# EAGLE design mainBoard_Gritsbot_3-0 (EAGLE 9.7.0)

## Sheet 1 of 5
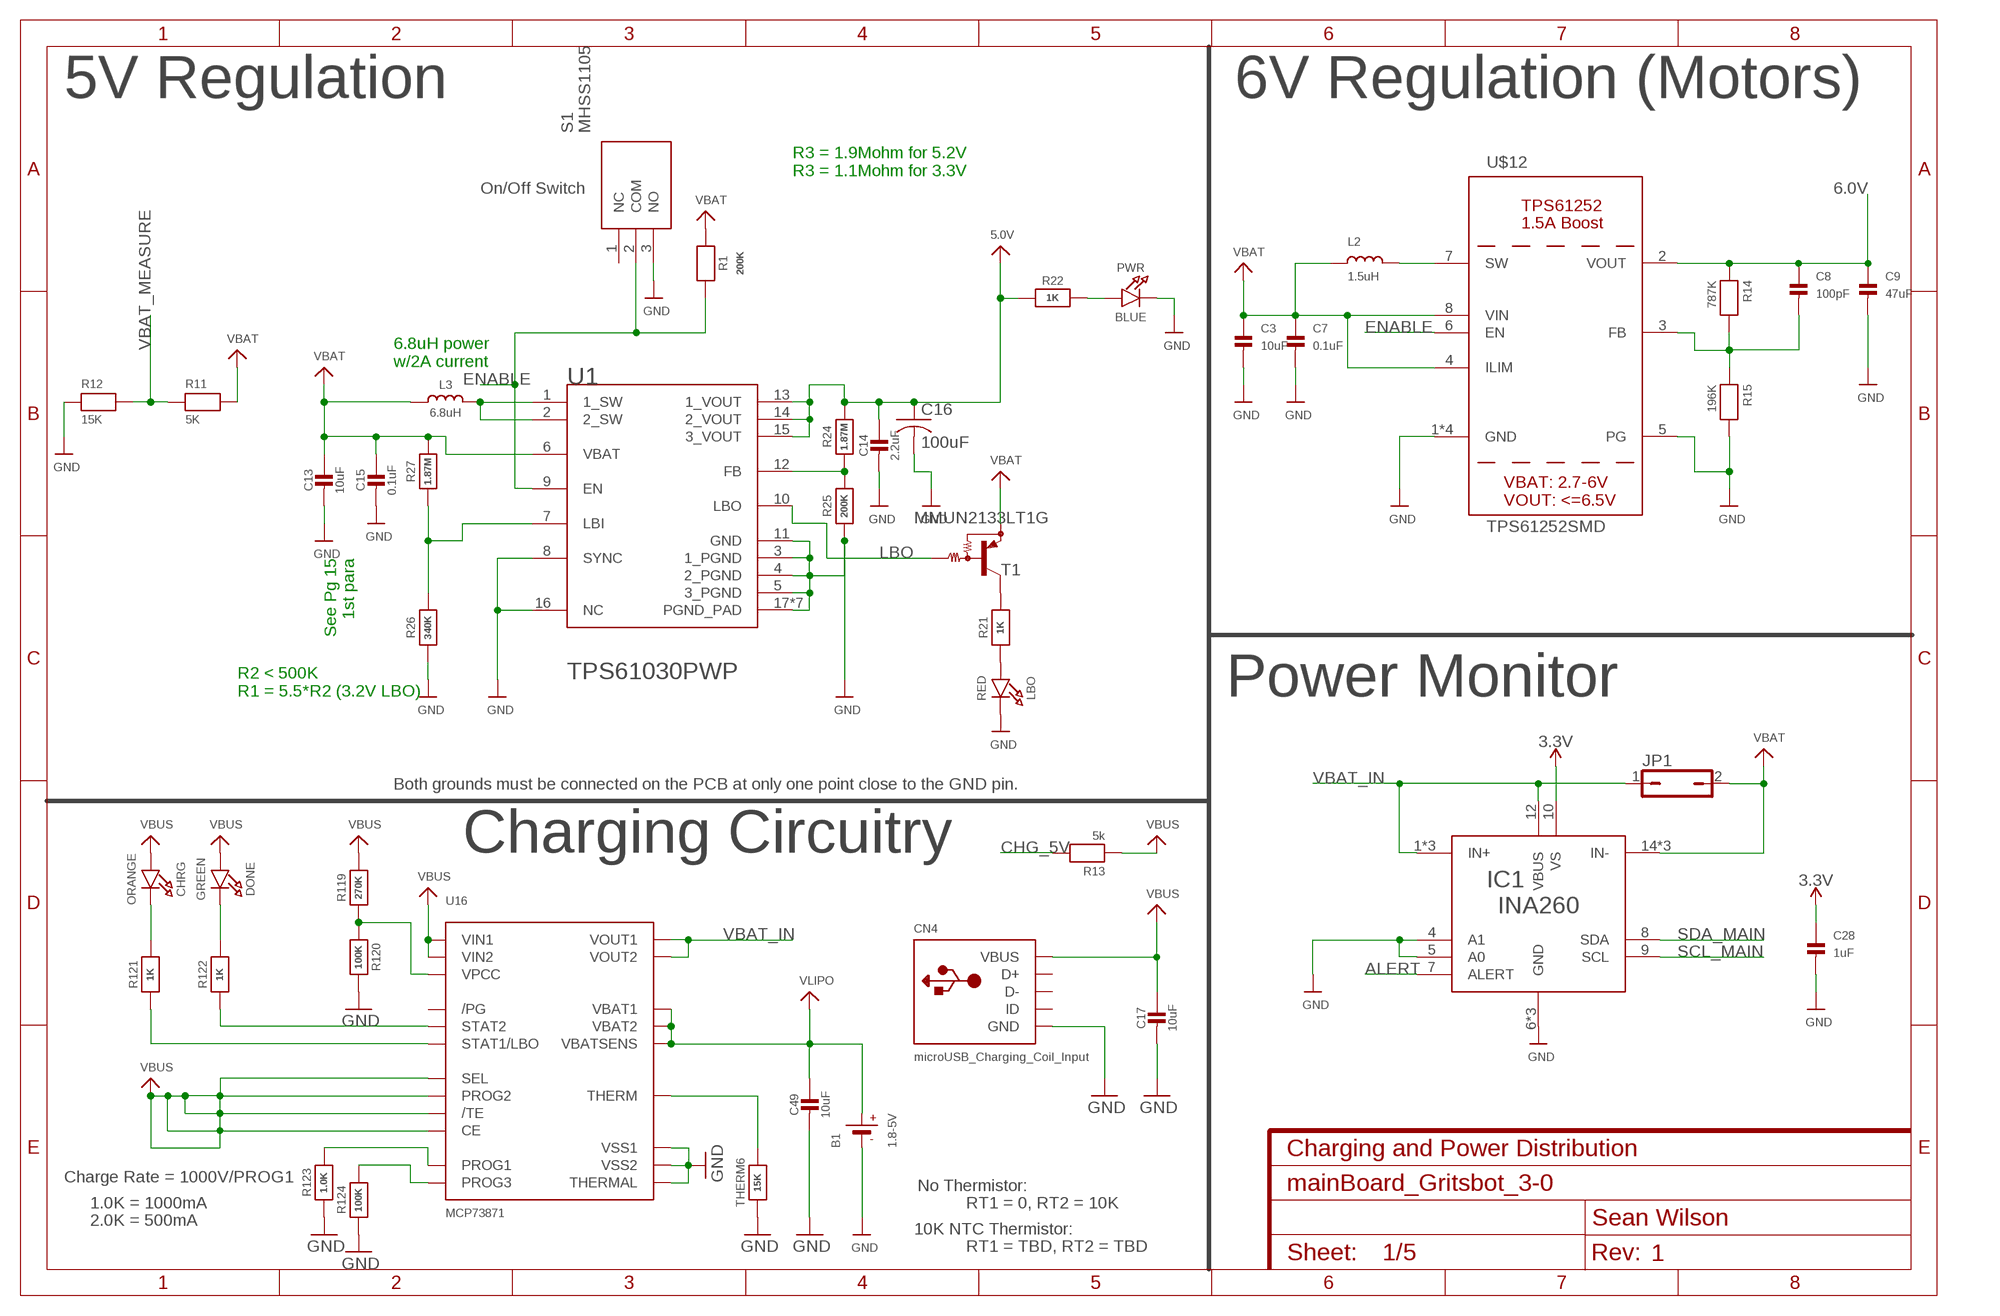
[diagram p0: schematic, sheet 1]
FRAME1 (FRAME-A4L): CNAME: Charging and Power Distribution; CREVISION: 1; DESIGNER: Sean Wilson

### Parts
B1  1.8-5V  BATTERY  [JSTPH2]
C3  10uF  CAP_CERAMIC0603  [0603]
C7  0.1uF  CAP_CERAMIC0805  [0805]
C8  100pF  CAP_CERAMIC0603  [0603]
C9  47uF  CAP_CERAMIC1206  [1206]
C13  10uF  CAP_CERAMIC0805-NOOUTLINE  [0805-NO]
C14  2.2uF  CAP_CERAMIC0805-NOOUTLINE  [0805-NO]
C15  0.1uF  CAP_CERAMIC0805_10MGAP  [0805_10MGAP]
C16  100uF  C-USC1210  [C1210]
C17  10uF  CAP_CERAMIC0805-NOOUTLINE  [0805-NO]
C28  1uF  CAP_CERAMIC0603_NO  [0603-NO]
C49  10uF  CAP_CERAMIC0805-NOOUTLINE  [0805-NO]
CHRG  ORANGE  LED0805_NOOUTLINE  [CHIPLED_0805_NOOUTLINE]
CN4  microUSB_Charging_Coil_Input  USBMICRO_20329  [4UCONN_20329]
DONE  GREEN  LED0805_NOOUTLINE  [CHIPLED_0805_NOOUTLINE]
IC1  INA260  [TSSOP16]
JP1  JP1Q  [JP1]
L2  1.5uH  MURATA_DFE252012P-1R5M=P2  [MURATA_DFE252012P-1R5M=P2]
L3  6.8uH  INDUCTORTDK_VLC5045  [INDUCTOR_5X5MM_TDK_VLC5045]
LBO  RED  LED0805_NOOUTLINE  [CHIPLED_0805_NOOUTLINE]
PWR  BLUE  LED0805_NOOUTLINE  [CHIPLED_0805_NOOUTLINE]
R1  200K  RESISTOR0805_NOOUTLINE  [0805-NO]
R11  5K  RESISTOR0805  [0805]
R12  15K  RESISTOR0805  [0805]
R13  5k  RESISTOR0805  [0805]
R14  787K  RESISTOR0805  [0805]
R15  196K  RESISTOR0805  [0805]
R21  1K  RESISTOR0805_NOOUTLINE  [0805-NO]
R22  1K  RESISTOR0805_NOOUTLINE  [0805-NO]
R24  1.87M  RESISTOR0805_NOOUTLINE  [0805-NO]
R25  200K  RESISTOR0805_NOOUTLINE  [0805-NO]
R26  340K  RESISTOR_0805MP  [_0805MP]
R27  1.87M  RESISTOR_0805MP  [_0805MP]
R119  270K  RESISTOR0805_NOOUTLINE  [0805-NO]
R120  100K  RESISTOR0805_NOOUTLINE  [0805-NO]
R121  1K  RESISTOR0805_NOOUTLINE  [0805-NO]
R122  1K  RESISTOR0805_NOOUTLINE  [0805-NO]
R123  1.0K  RESISTOR0805_NOOUTLINE  [0805-NO]
R124  100K  RESISTOR0805_NOOUTLINE  [0805-NO]
S1  MHSS1105  [MHSS1105]
T1  MMUN2133LT1G  MUN2114T1-PNP_DRIVER-SC59-BEC  [SC59-BEC]
THERM6  15K  RESISTOR0805_NOOUTLINE  [0805-NO]
U1  TEXAS_INSTRUMENTS_TPS61030PWPTEXAS_INSTRUMENTS_TPS61030PWP_0_0  [TEXAS_INSTRUMENTS_TPS61030PWP_0]
U16  MCP73871  [QFN20_4MM]
U$12  TPS61252SMD  [TPS61252]

### Nets
3.3V: C28.1 IC1.10(VS) ; also sheet 2,4,5
5.0V: C14.1 C16.1 R22.1 R24.2 U1.13(1_VOUT) U1.14(2_VOUT) U1.15(3_VOUT) ; also sheet 2,3
6.0V: C8.1 C9.1 R14.1 U$12.2(VOUT) ; also sheet 3
ALERT: IC1.7(ALERT)
CHG_5V: R13.2 ; also sheet 2
ENABLE: R1.2 S1.2(COM) U1.9(EN) U$12.6(EN)
GND: B1.1(-) C3.2 C7.2 C9.2 C13.2 C14.2 C15.2 C16.2 C17.2 C28.2 C49.2 CN4.BASE@1(GND) CN4.BASE@2(GND) CN4.GND CN4.SPRT@1(GND) CN4.SPRT@2(GND) CN4.SPRT@3(GND) CN4.SPRT@4(GND) IC1.4(A1) IC1.5(A0) IC1.6(GND) IC1.11(GND) IC1.13(GND) LBO.C PWR.C R12.1 R15.2 R25.1 R26.1 R120.2 R123.1 R124.1 S1.3(NO) THERM6.1 U1.3(1_PGND) U1.4(2_PGND) U1.5(3_PGND) U1.8(SYNC) U1.11(GND) U1.16(NC) U1.17(PGND_PAD) U1.PAD_1(PGND_PAD) U1.PAD_2(PGND_PAD) U1.PAD_3(PGND_PAD) U1.PAD_4(PGND_PAD) U1.PAD_5(PGND_PAD) U1.PAD_6(PGND_PAD) U16.P$10(VSS1) U16.P$11(VSS2) U16.P$21(THERMAL) U$12.1(GND) U$12.5(PG) U$12.P$2_GND(GND) U$12.P$3_GND(GND) U$12.THERMAL_GND(GND) ; also sheet 2,3,4,5
LBO: T1.B U1.10(LBO)
N$1: R24.1 R25.2 U1.12(FB)
N$11: L2.P$2 U$12.7(SW)
N$12: C8.2 R14.2 R15.1 U$12.3(FB)
N$13: L3.P$2 U1.1(1_SW) U1.2(2_SW)
N$14: R26.2 R27.1 U1.7(LBI)
N$15: LBO.A R21.1
N$17: R21.2 T1.C
N$19: PWR.A R22.2
N$100: R119.1 R120.1 U16.P$2(VPCC)
N$101: R122.1 U16.P$7(STAT2)
N$102: R121.1 U16.P$8(STAT1/LBO)
N$103: R123.2 U16.P$13(PROG1)
N$104: THERM6.2 U16.P$5(THERM)
N$105: DONE.C R122.2
N$106: CHRG.C R121.2
N$107: R124.2 U16.P$12(PROG3)
SCL_MAIN: IC1.9(SCL) ; also sheet 2,4,5
SDA_MAIN: IC1.8(SDA) ; also sheet 2,4,5
VBAT: C3.1 C7.1 C13.1 C15.1 IC1.14(IN-) IC1.15(IN-) IC1.16(IN-) JP1.2 L2.P$1 L3.P$1 R1.1 R11.2 R27.2 T1.E U1.6(VBAT) U$12.4(ILIM) U$12.8(VIN)
VBAT_IN: IC1.1(IN+) IC1.2(IN+) IC1.3(IN+) IC1.12(VBUS) JP1.1 U16.P$1(VOUT1) U16.P$20(VOUT2)
VBAT_MEASURE: R11.1 R12.2 ; also sheet 2
VBUS: C17.1 CHRG.A CN4.VBUS DONE.A R13.1 R119.2 U16.P$3(SEL) U16.P$4(PROG2) U16.P$9(/TE) U16.P$17(CE) U16.P$18(VIN1) U16.P$19(VIN2)
VLIPO: B1.2(+) C49.1 U16.P$14(VBAT1) U16.P$15(VBAT2) U16.P$16(VBATSENS)
Unconnected: CN4.D+ CN4.D- CN4.ID S1.1(NC) U16.P$6(/PG)

### Notes on the sheet
- 5V Regulation | 6V Regulation (Motors)
- R3 = 1.9Mohm for 5.2V
  R3 = 1.1Mohm for 3.3V
- On/Off Switch
- 6.8uH power
  w/2A current
- See Pg 15
  1st para
- R2 < 500K
  R1 = 5.5*R2 (3.2V LBO)
- Power Monitor
- Both grounds must be connected on the PCB at only one point close to the GND pin.
- Charging Circuitry
- Charge Rate = 1000V/PROG1
- No Thermistor:
- 1.0K = 1000mA | RT1 = 0, RT2 = 10K
- 2.0K = 500mA
- 10K NTC Thermistor:
- RT1 = TBD, RT2 = TBD

## Sheet 2 of 5
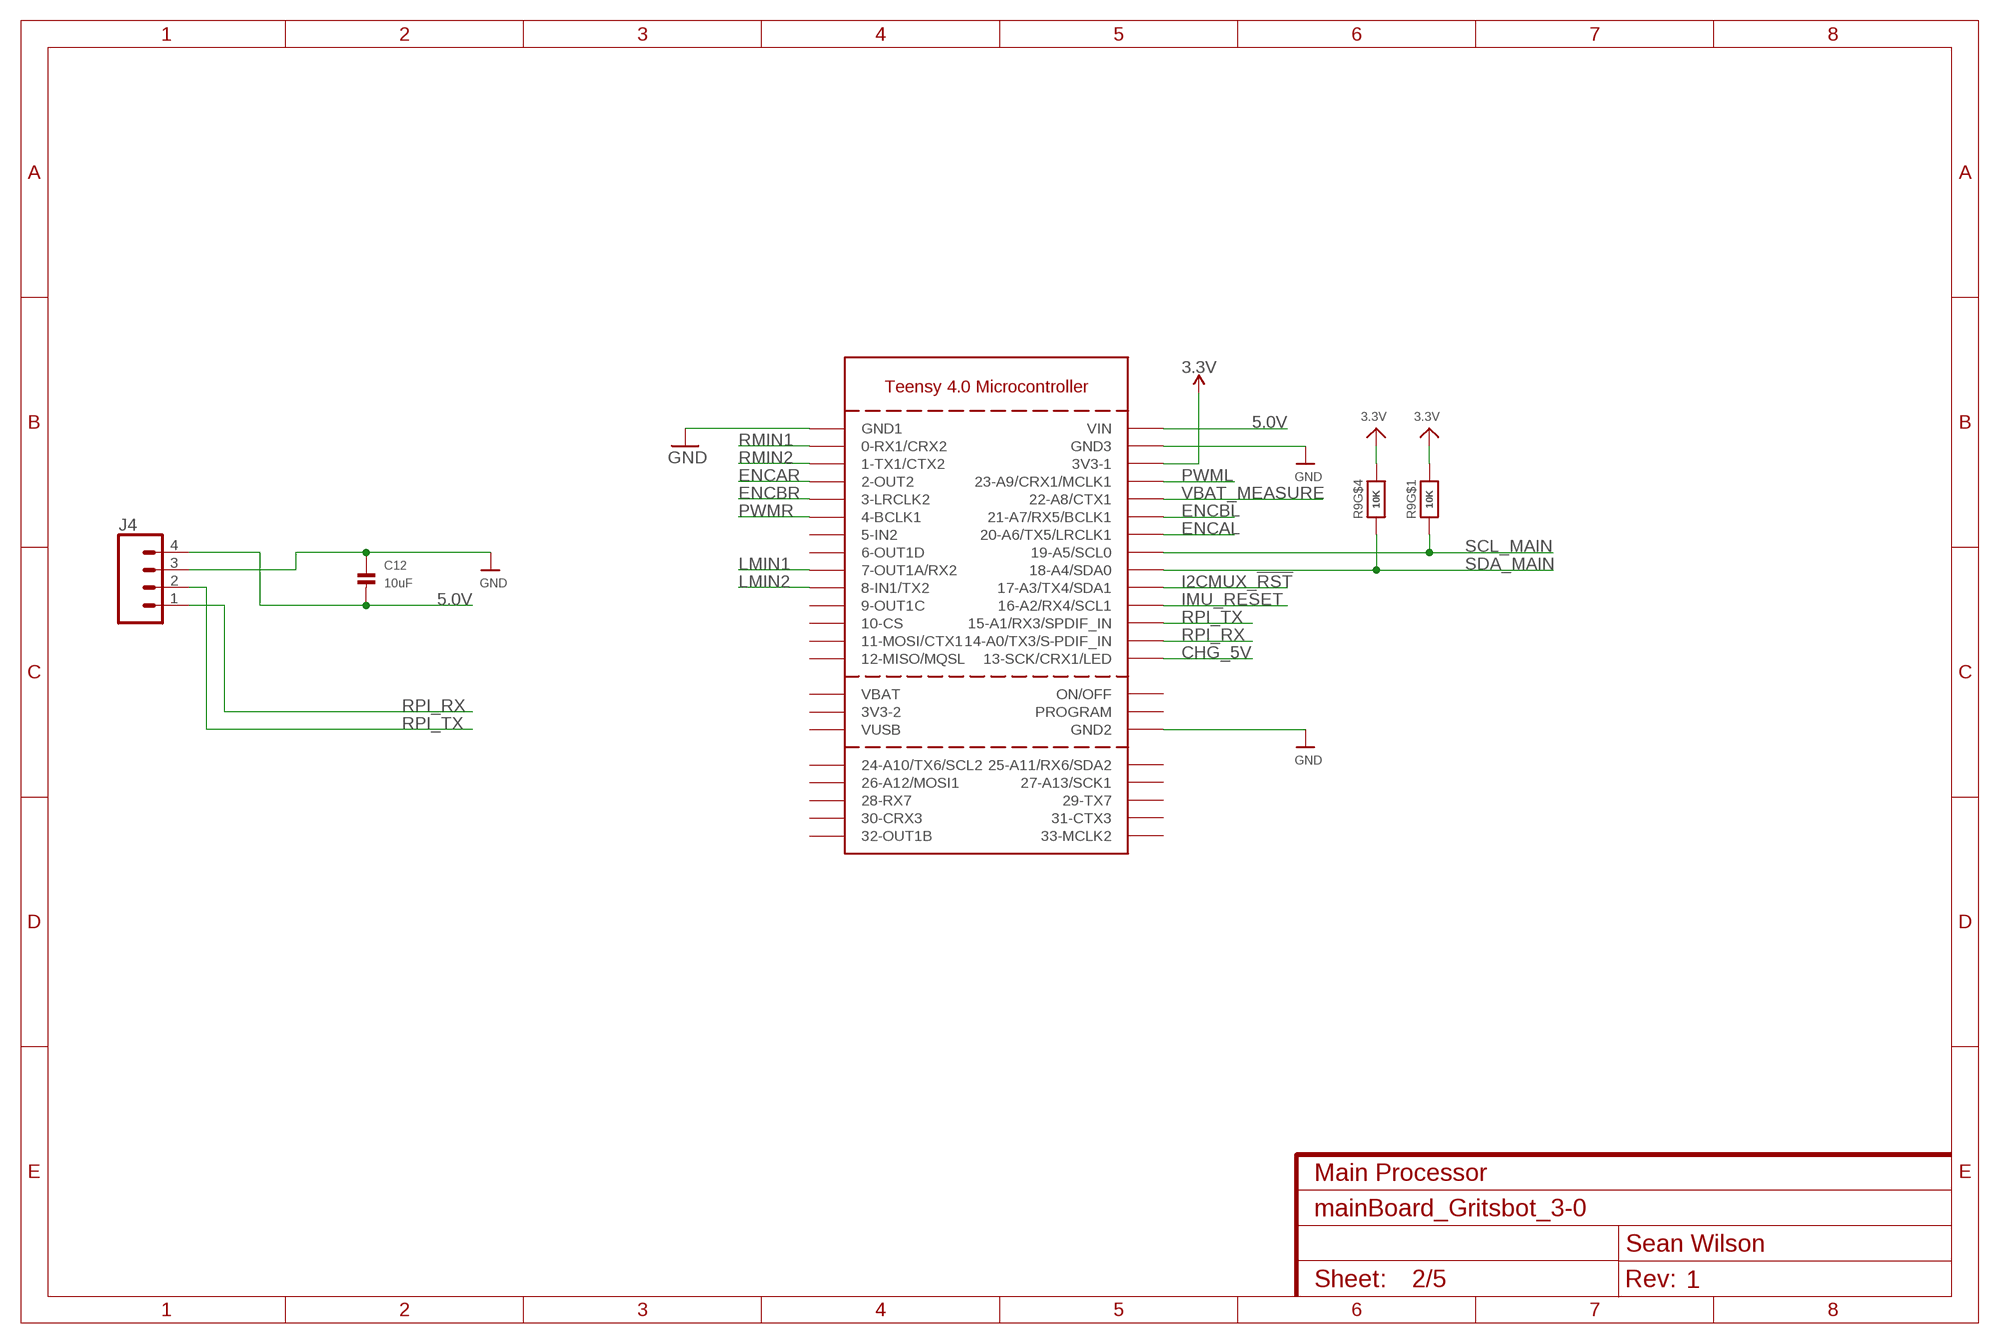
[diagram p1: schematic, sheet 2]
FRAME2 (FRAME-A4L): CNAME: Main Processor; CREVISION: 1; DESIGNER: Sean Wilson

### Parts
C12  10uF  CAP_CERAMIC0603  [0603]
J4  CONN_041X04_NO_SILK  [1X04_NO_SILK]
R9  10K  RESISTOR_4PACK  [RESPACK_4X0603]
U$57  TEENSY40  [TEENSY40]

### Nets
3.3V: R9.1 R9.4 U$57.3V3-1 ; also sheet 1,4,5
5.0V: C12.2 J4.4 U$57.VIN ; also sheet 1,3
CHG_5V: U$57.13-SCK/CRX1/LED ; also sheet 1
ENCAL: U$57.20-A6/TX5/LRCLK1 ; also sheet 3
ENCAR: U$57.2-OUT2 ; also sheet 3
ENCBL: U$57.21-A7/RX5/BCLK1 ; also sheet 3
ENCBR: U$57.3-LRCLK2 ; also sheet 3
GND: C12.1 J4.3 U$57.GND1 U$57.GND2 U$57.GND3 ; also sheet 1,3,4,5
I2CMUX_!RST: U$57.17-A3/TX4/SDA1 ; also sheet 4
IMU_RESET: U$57.16-A2/RX4/SCL1 ; also sheet 5
LMIN1: U$57.7-RX2/OUT1A(7-OUT1A/RX2) ; also sheet 3
LMIN2: U$57.8-TX2/IN1(8-IN1/TX2) ; also sheet 3
PWML: U$57.23-A9/CRX1/CCLK1(23-A9/CRX1/MCLK1) ; also sheet 3
PWMR: U$57.4-BCLK2(4-BCLK1) ; also sheet 3
RMIN1: U$57.0-RX1(0-RX1/CRX2) ; also sheet 3
RMIN2: U$57.1-TX1(1-TX1/CTX2) ; also sheet 3
RPI_RX: J4.1 U$57.14-A0/TX3/S-PFI_OUT(14-A0/TX3/S-PDIF_IN)
RPI_TX: J4.2 U$57.15-A1/RX3/S-PDIF_IN(15-A1/RX3/SPDIF_IN)
SCL_MAIN: R9.8 U$57.19-A5/SCL0 ; also sheet 1,4,5
SDA_MAIN: R9.5 U$57.18-A4/SDA0 ; also sheet 1,4,5
VBAT_MEASURE: U$57.22-A8/CTX1 ; also sheet 1
Unconnected: R9.2 R9.3 R9.6 R9.7 U$57.3V3-2 U$57.5-IN2 U$57.6-OUT1D U$57.9-OUT1C U$57.10-CS/MQSR(10-CS) U$57.11-MOSI/CTX1 U$57.12-MIO/MQSL(12-MISO/MQSL) U$57.24-A10/TX6/SCL2 U$57.25-A11/SDA2(25-A11/RX6/SDA2) U$57.26-A12/MOSI1 U$57.27-A13/SCK1 U$57.28-RX7 U$57.29-TX7 U$57.30-CRX3 U$57.31-CTX3 U$57.32-OUTB1(32-OUT1B) U$57.33-MCLK2 U$57.ON/OFF U$57.PROGRAM U$57.VBAT U$57.VUSB

## Sheet 3 of 5
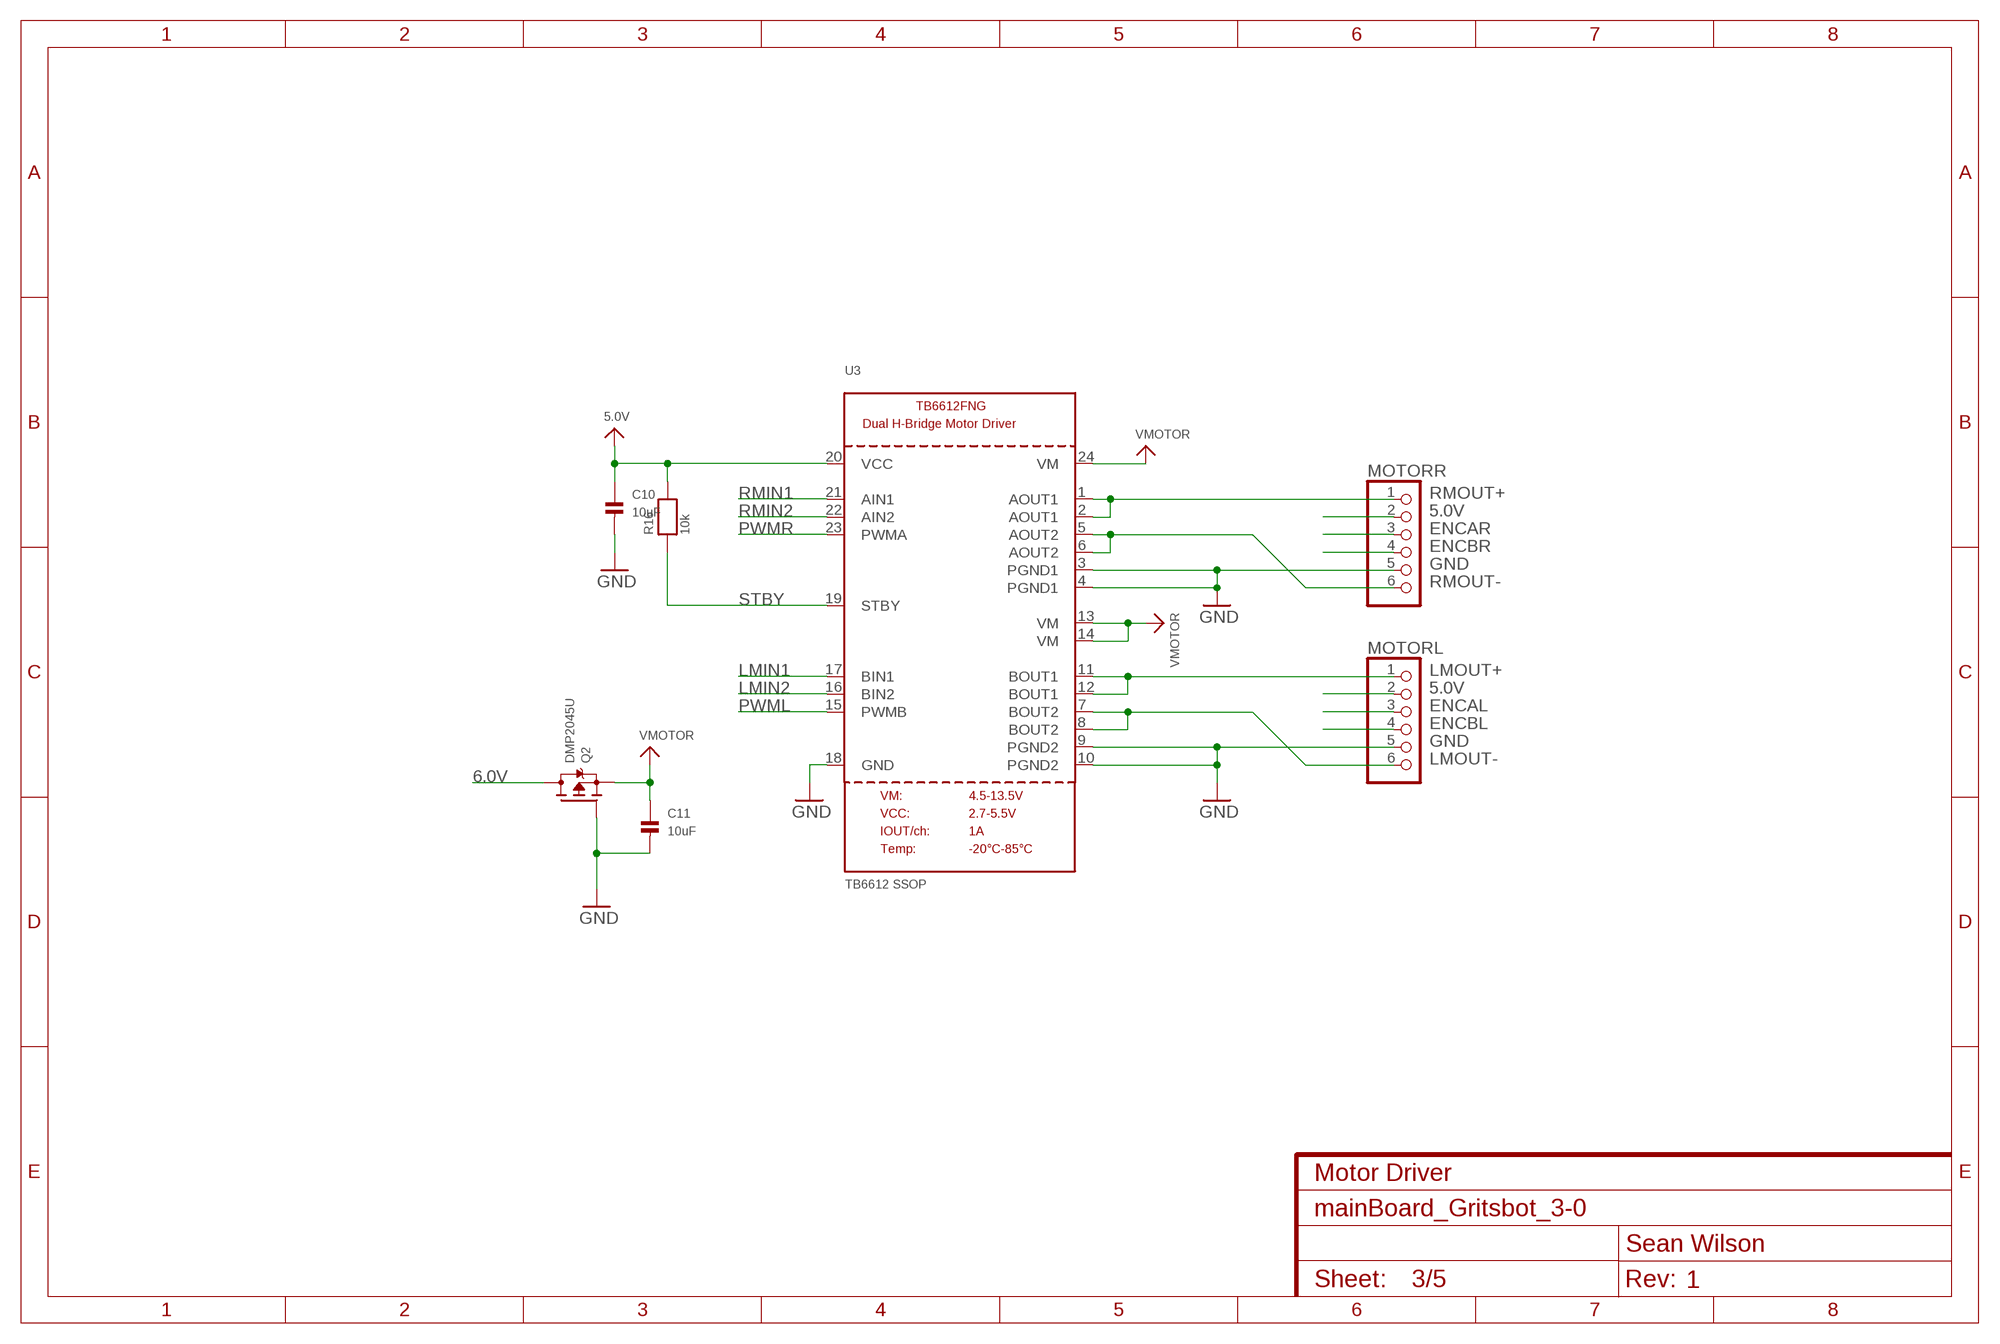
[diagram p2: schematic, sheet 3]
FRAME3 (FRAME-A4L): CNAME: Motor Driver; CREVISION: 1; DESIGNER: Sean Wilson

### Parts
C10  10uF  CAP_CERAMIC0603  [0603]
C11  10uF  CAP_CERAMIC0603  [0603]
MOTORL  PINHD-1X6CB  [1X06-CLEANBIG]
MOTORR  PINHD-1X6CB  [1X06-CLEANBIG]
Q2  DMP2045U  MOSFET-PWIDE  [SOT23-WIDE]
R16  10k  RESISTOR0805  [0805]
U3  TB6612 SSOP  TB6612FNGSSOP  [SSOP24]

### Nets
5.0V: C10.1 MOTORL.2 MOTORR.2 R16.2 U3.20(VCC) ; also sheet 1,2
6.0V: Q2.3(D) ; also sheet 1
ENCAL: MOTORL.3 ; also sheet 2
ENCAR: MOTORR.3 ; also sheet 2
ENCBL: MOTORL.4 ; also sheet 2
ENCBR: MOTORR.4 ; also sheet 2
GND: C10.2 C11.2 MOTORL.5 MOTORR.5 Q2.1(G) U3.3(PGND1) U3.4(PGND1) U3.9(PGND2) U3.10(PGND2) U3.18(GND) ; also sheet 1,2,4,5
LMIN1: U3.17(BIN1) ; also sheet 2
LMIN2: U3.16(BIN2) ; also sheet 2
LMOUT+: MOTORL.1 U3.11(BOUT1) U3.12(BOUT1)
LMOUT-: MOTORL.6 U3.7(BOUT2) U3.8(BOUT2)
PWML: U3.15(PWMB) ; also sheet 2
PWMR: U3.23(PWMA) ; also sheet 2
RMIN1: U3.21(AIN1) ; also sheet 2
RMIN2: U3.22(AIN2) ; also sheet 2
RMOUT+: MOTORR.1 U3.1(AOUT1) U3.2(AOUT1)
RMOUT-: MOTORR.6 U3.5(AOUT2) U3.6(AOUT2)
STBY: R16.1 U3.19(STBY)
VMOTOR: C11.1 Q2.2(S) U3.13(VM) U3.14(VM) U3.24(VM)

## Sheet 4 of 5
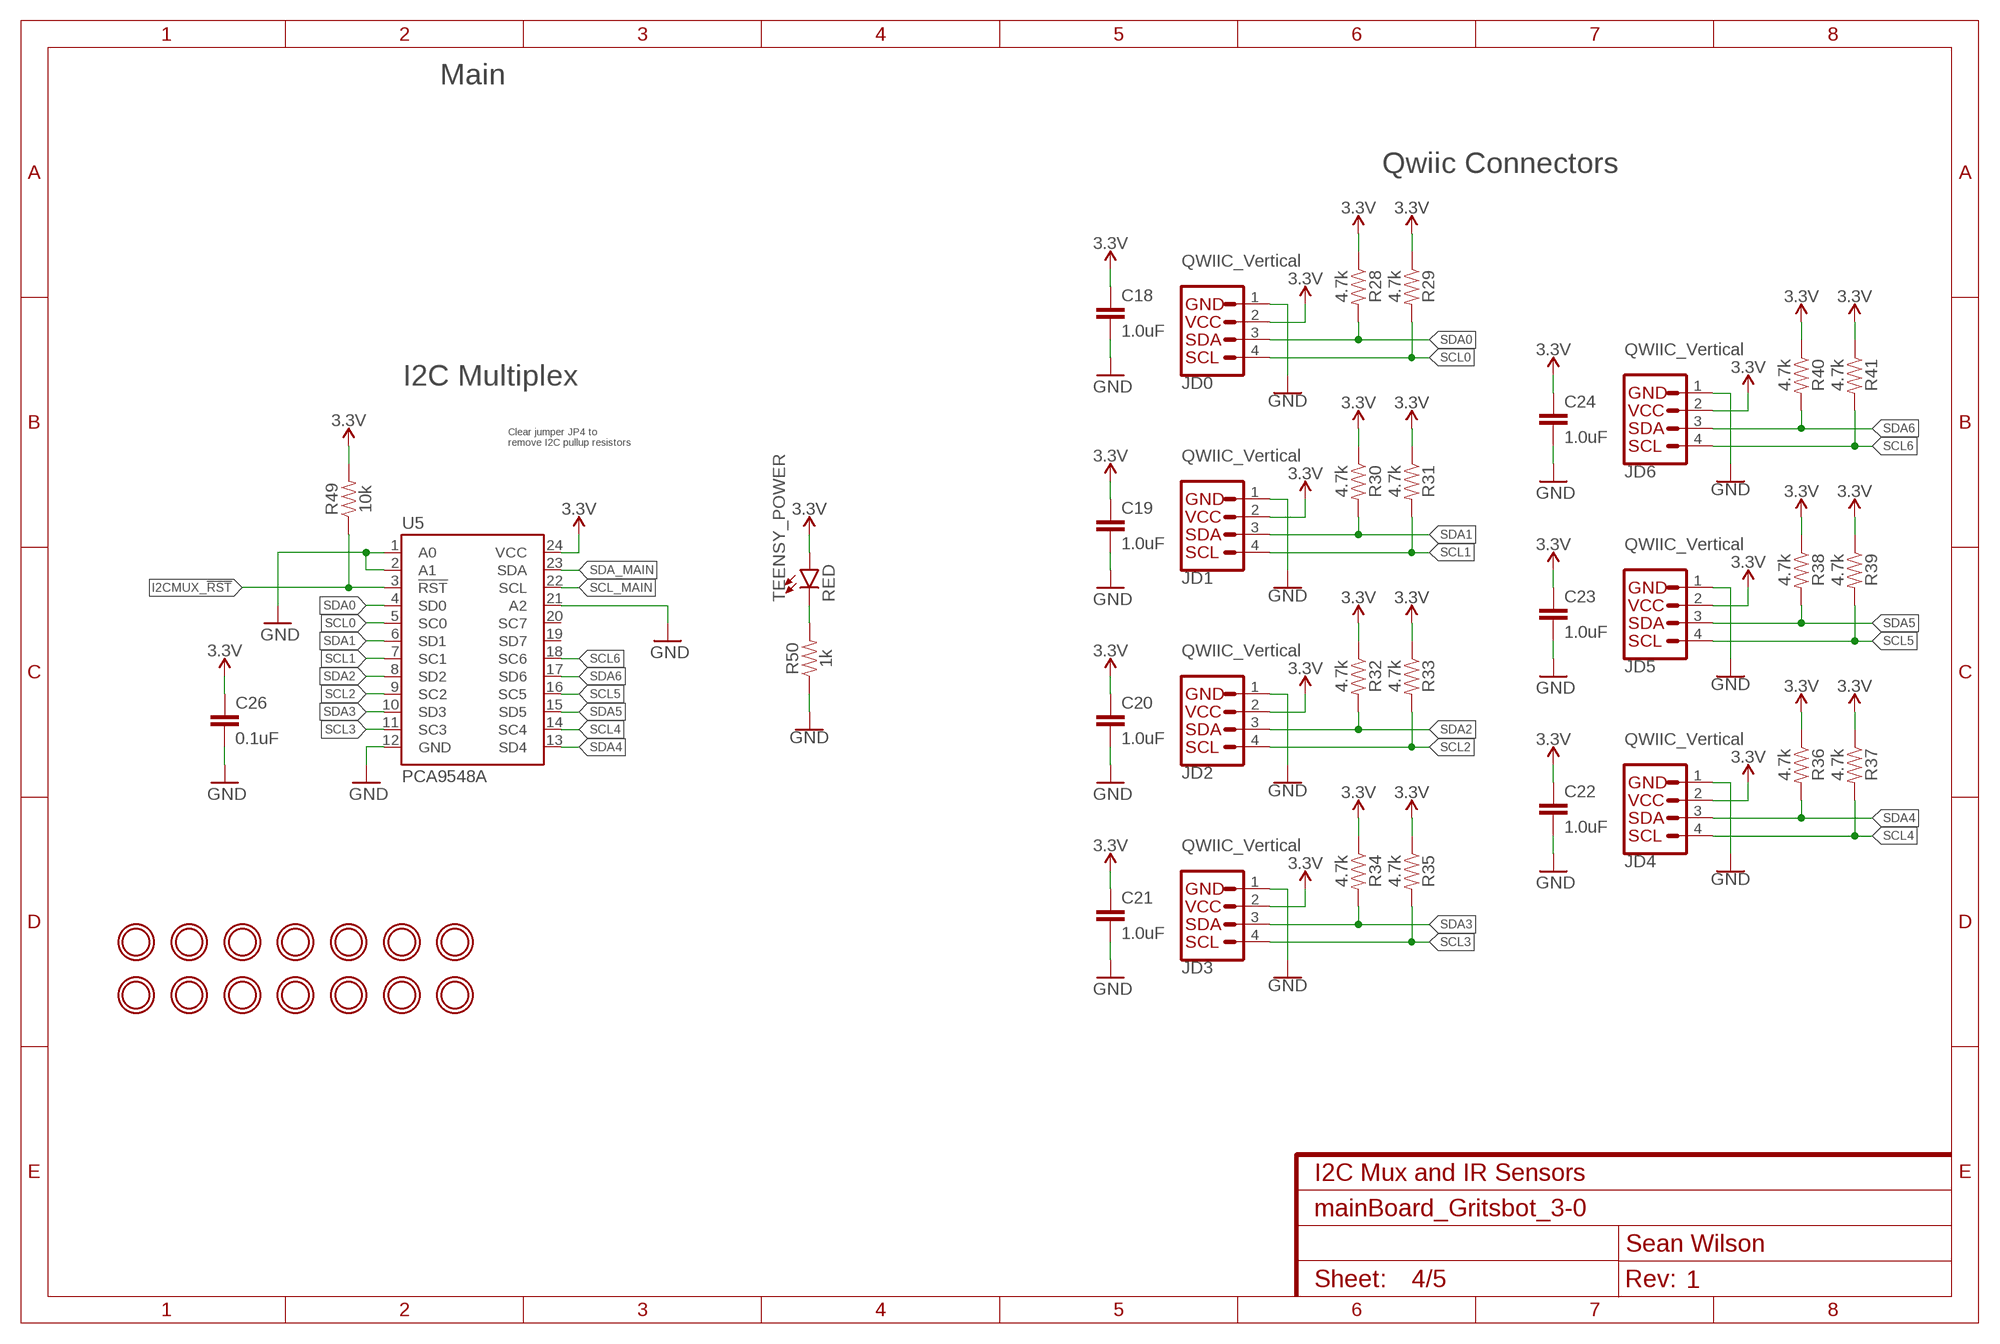
[diagram p3: schematic, sheet 4]
FRAME4 (FRAME-A4L): CNAME: I2C Mux and IR Sensors; CREVISION: 1; DESIGNER: Sean Wilson

### Parts
C18  1.0uF  1.0UF-0603-16V-10%  [0603]
C19  1.0uF  1.0UF-0603-16V-10%  [0603]
C20  1.0uF  1.0UF-0603-16V-10%  [0603]
C21  1.0uF  1.0UF-0603-16V-10%  [0603]
C22  1.0uF  1.0UF-0603-16V-10%  [0603]
C23  1.0uF  1.0UF-0603-16V-10%  [0603]
C24  1.0uF  1.0UF-0603-16V-10%  [0603]
C26  0.1uF  0.1UF-0603-25V-(+80/-20%)  [0603]
JD0  QWIIC_Vertical  QWIIC_CONNECTOR  [JST04_1MM_VERT]
JD1  QWIIC_Vertical  QWIIC_CONNECTOR  [JST04_1MM_VERT]
JD2  QWIIC_Vertical  QWIIC_CONNECTOR  [JST04_1MM_VERT]
JD3  QWIIC_Vertical  QWIIC_CONNECTOR  [JST04_1MM_VERT]
JD4  QWIIC_Vertical  QWIIC_CONNECTOR  [JST04_1MM_VERT]
JD5  QWIIC_Vertical  QWIIC_CONNECTOR  [JST04_1MM_VERT]
JD6  QWIIC_Vertical  QWIIC_CONNECTOR  [JST04_1MM_VERT]
R28  4.7k  4.7KOHM-0603-1/10W-1%  [0603]
R29  4.7k  4.7KOHM-0603-1/10W-1%  [0603]
R30  4.7k  4.7KOHM-0603-1/10W-1%  [0603]
R31  4.7k  4.7KOHM-0603-1/10W-1%  [0603]
R32  4.7k  4.7KOHM-0603-1/10W-1%  [0603]
R33  4.7k  4.7KOHM-0603-1/10W-1%  [0603]
R34  4.7k  4.7KOHM-0603-1/10W-1%  [0603]
R35  4.7k  4.7KOHM-0603-1/10W-1%  [0603]
R36  4.7k  4.7KOHM-0603-1/10W-1%  [0603]
R37  4.7k  4.7KOHM-0603-1/10W-1%  [0603]
R38  4.7k  4.7KOHM-0603-1/10W-1%  [0603]
R39  4.7k  4.7KOHM-0603-1/10W-1%  [0603]
R40  4.7k  4.7KOHM-0603-1/10W-1%  [0603]
R41  4.7k  4.7KOHM-0603-1/10W-1%  [0603]
R49  10k  10KOHM-0603-1/10W-1%  [0603]
R50  1k  1KOHM-0603-1/10W-1%  [0603]
TEENSY_POWER  RED  LED-RED0603  [LED-0603]
U5  PCA9548A  [TSSOP28]
U$8  MOUNTINGHOLE2.5  [MOUNTINGHOLE_2.5_PLATED]
U$30  MOUNTINGHOLE2.5  [MOUNTINGHOLE_2.5_PLATED]
U$31  MOUNTINGHOLE2.5  [MOUNTINGHOLE_2.5_PLATED]
U$32  MOUNTINGHOLE2.5  [MOUNTINGHOLE_2.5_PLATED]
U$33  MOUNTINGHOLE2.5  [MOUNTINGHOLE_2.5_PLATED]
U$34  MOUNTINGHOLE2.5  [MOUNTINGHOLE_2.5_PLATED]
U$35  MOUNTINGHOLE2.5  [MOUNTINGHOLE_2.5_PLATED]
U$36  MOUNTINGHOLE2.5  [MOUNTINGHOLE_2.5_PLATED]
U$37  MOUNTINGHOLE2.5  [MOUNTINGHOLE_2.5_PLATED]
U$43  MOUNTINGHOLE2.5  [MOUNTINGHOLE_2.5_PLATED]
U$45  MOUNTINGHOLE2.5  [MOUNTINGHOLE_2.5_PLATED]
U$46  MOUNTINGHOLE2.5  [MOUNTINGHOLE_2.5_PLATED]
U$47  MOUNTINGHOLE2.5  [MOUNTINGHOLE_2.5_PLATED]
U$48  MOUNTINGHOLE2.5  [MOUNTINGHOLE_2.5_PLATED]

### Nets
3.3V: C18.1 C19.1 C20.1 C21.1 C22.1 C23.1 C24.1 C26.1 JD0.2 JD1.2 JD2.2 JD3.2 JD4.2 JD5.2 JD6.2 R28.1 R29.1 R30.1 R31.1 R32.1 R33.1 R34.1 R35.1 R36.1 R37.1 R38.1 R39.1 R40.1 R41.1 R49.2 TEENSY_POWER.A U5.24(VCC) ; also sheet 1,2,5
GND: C18.2 C19.2 C20.2 C21.2 C22.2 C23.2 C24.2 C26.2 JD0.1 JD1.1 JD2.1 JD3.1 JD4.1 JD5.1 JD6.1 R50.1 U5.1(A0) U5.2(A1) U5.12(GND) U5.21(A2) ; also sheet 1,2,3,5
I2CMUX_!RST: R49.1 U5.3(!RST) ; also sheet 2
N$22: R50.2 TEENSY_POWER.C
SCL0: JD0.4 R29.2 U5.5(SC0)
SCL1: JD1.4 R31.2 U5.7(SC1)
SCL2: JD2.4 R33.2 U5.9(SC2)
SCL3: JD3.4 R35.2 U5.11(SC3)
SCL4: JD4.4 R37.2 U5.14(SC4)
SCL5: JD5.4 R39.2 U5.16(SC5)
SCL6: JD6.4 R41.2 U5.18(SC6)
SCL_MAIN: U5.22(SCL) ; also sheet 1,2,5
SDA0: JD0.3 R28.2 U5.4(SD0)
SDA1: JD1.3 R30.2 U5.6(SD1)
SDA2: JD2.3 R32.2 U5.8(SD2)
SDA3: JD3.3 R34.2 U5.10(SD3)
SDA4: JD4.3 R36.2 U5.13(SD4)
SDA5: JD5.3 R38.2 U5.15(SD5)
SDA6: JD6.3 R40.2 U5.17(SD6)
SDA_MAIN: U5.23(SDA) ; also sheet 1,2,5
Unconnected: U5.19(SD7) U5.20(SC7)

### Notes on the sheet
- Main
- Qwiic Connectors
- I2C Multiplex
- Clear jumper JP4 to 
  remove I2C pullup resistors

## Sheet 5 of 5
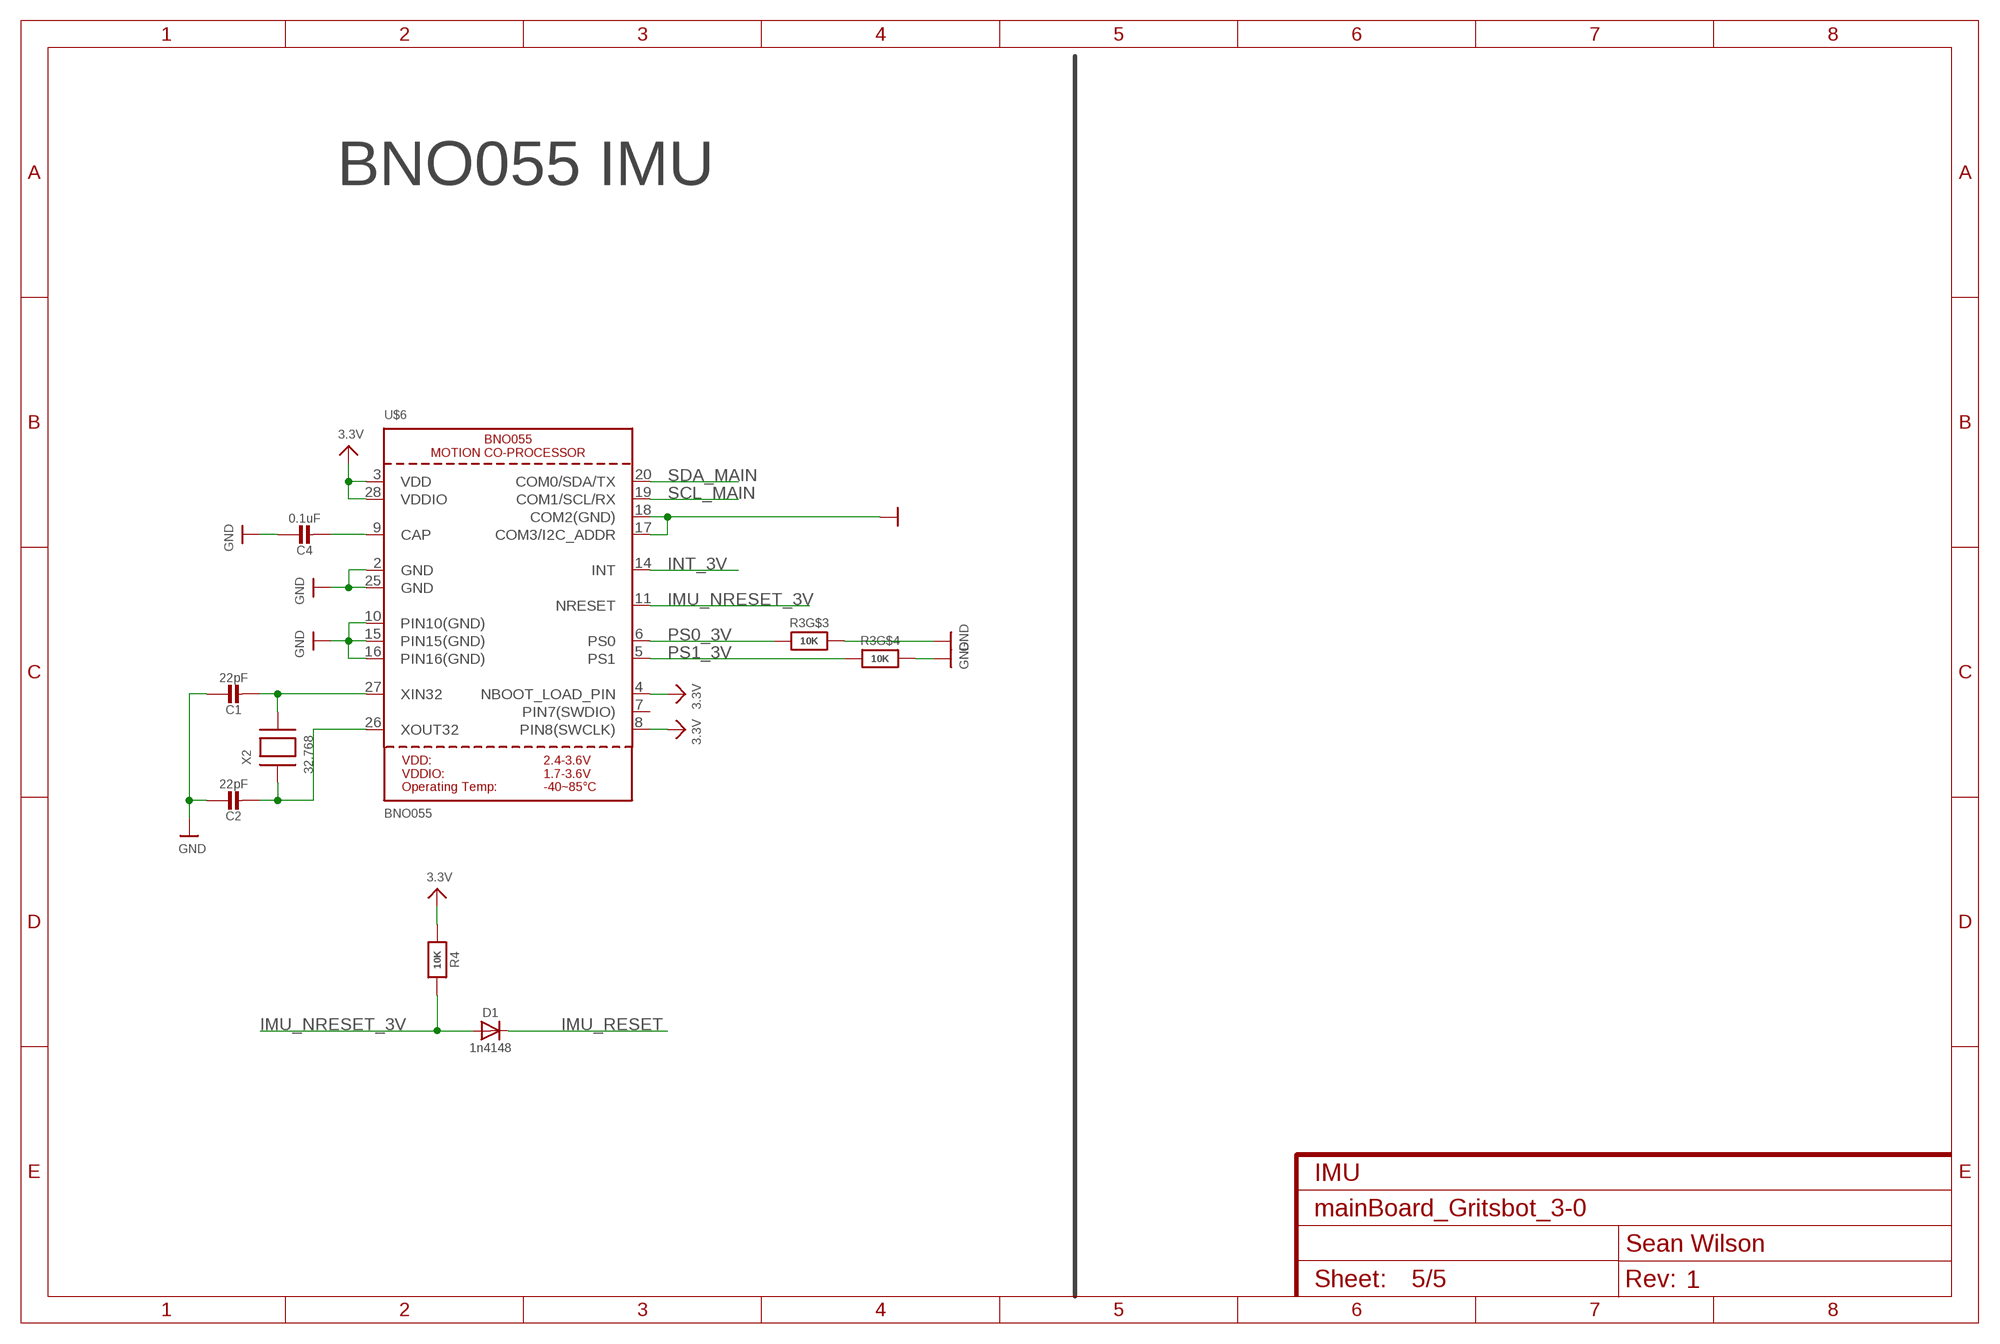
[diagram p4: schematic, sheet 5]
FRAME5 (FRAME-A4L): CNAME: IMU; CREVISION: 1; DESIGNER: Sean Wilson

### Parts
C1  22pF  CAP_CERAMIC0603_NO  [0603-NO]
C2  22pF  CAP_CERAMIC0603_NO  [0603-NO]
C4  0.1uF  CAP_CERAMIC0603_NO  [0603-NO]
D1  1n4148  DIODESOD-323  [SOD-323]
R3  10K  RESISTOR_4PACK  [RESPACK_4X0603]
R4  10K  RESISTOR_0603_NOOUT  [0603-NO]
U$6  BNO055  [BNO055]
X2  32.768  XTAL-3.2X1.5  [XTAL3215]

### Nets
3.3V: R4.1 U$6.3(VDD) U$6.4(NBOOT_LOAD_PIN) U$6.8(PIN8(SWCLK)) U$6.28(VDDIO) ; also sheet 1,2,4
GND: C1.1 C2.1 C4.1 R3.5 R3.6 U$6.2(GND) U$6.10(PIN10(GND)) U$6.15(PIN15(GND)) U$6.16(PIN16(GND)) U$6.17(COM3/I2C_ADDR) U$6.18(COM2(GND)) U$6.25(GND) ; also sheet 1,2,3,4
IMU_NRESET_3V: D1.A R4.2 U$6.11(NRESET)
IMU_RESET: D1.C ; also sheet 2
INT_3V: U$6.14(INT)
N$3: C1.2 U$6.27(XIN32) X2.P$2
N$4: C2.2 U$6.26(XOUT32) X2.P$1
N$5: C4.2 U$6.9(CAP)
PS0_3V: R3.3 U$6.6(PS0)
PS1_3V: R3.4 U$6.5(PS1)
SCL_MAIN: U$6.19(COM1/SCL/RX) ; also sheet 1,2,4
SDA_MAIN: U$6.20(COM0/SDA/TX) ; also sheet 1,2,4
Unconnected: R3.1 R3.2 R3.7 R3.8 U$6.7(PIN7(SWDIO))

### Notes on the sheet
- BNO055 IMU

## Library data of the parts
B1 = microbuilder:BATTERY: CR1220 SMT - Digikey: 3001K-ND CD2032 BAT-HLD-001 - Digikey: BAT-HLD-001-ND
C1-C4 C7-C15 C17 C28 C49 = microbuilder:CAP_CERAMIC: Ceramic Capacitors
C16 = rcl:C-US: CAPACITOR, American symbol
C18-C24 = SparkFun-Capacitors:1.0UF: 1µF ceramic capacitors A capacitor is a passive two-terminal electrical component used to store electrical energy temporarily in an electric field.; PROD_ID: CAP-00868
C26 = SparkFun-Capacitors:0.1UF: 0.1µF ceramic capacitors A capacitor is a passive two-terminal electrical component used to store electrical energy temporarily in an electric field.; PROD_ID: CAP-00810
CHRG DONE LBO PWR = microbuilder:LED: LED 0603 - 0603 Surface Mount Package 2mA: Green LED - Low Power (3.9mcd, 2ma, 1.7Vf) - Digikey: 475-2709-2-ND Orange LED - Low Power (9.8mcd, 2ma, 1.8Vf) - Digikey: 475-1194-2-ND Red LED - Low Power (5mcd, 2ma, 1.8Vf) - Digikey: 475-1195-2-ND Yellow LED - Low Power (7mcd, 2ma, 1.8Vf) - Digikey: 475-1196-2-ND 5mA: Blue LED - Low Power (17mcd, 5ma, 2.9Vf) - Digikey: LNJ937W8CRACT-ND 0805 - 0805 Surface Mount Package 2mA: Red LED (8.8mcd, 2mA, 1.8Vf, Clear) - Low Power [Digikey: 475-2510-1-ND] Green LED (5mcd, 2mA, 1.8Vf, Clear) - Low Power [Digikey: 475-2730-1-ND] Yellow LED (11.3mcd, 2mA, 1.8Vf, Clear) - Low Power [Digikey: 475-2555-1-ND] 20mA: Red LED (104mcd, 20mA, Diffused) - LS R976 [Digikey: 475-1278-6-ND] Red LED (12mcd, 20mA, 2.0Vf, Clear) - APT2012EC [Digikey: 754-1128-1-ND] Green LED (15mcd, 20mA, 2.2Vf, Clear) - APT2012GC [Digikey: 754-1131-1-ND] Orange LED (160mcd, 20mA, 2.1Vf, Clear) - APT2012SECK [Digikey: 754-1130-1-ND] 1206 - 1206 Surface Mount Package Green LED (26mcd, 20mA, Diffused) - LG N971 [Digikey: 475-1407-6-ND] Red LED (15mcd, 20mA, Diffused) - LH N974 [Digikey: 475-1416-6-ND] Cree - Cree High-Power Surface Mount LEDs XPEBWT-L1-0000-00D50 - White 111lm 350mA 2.9Vf 6200K 110° XTEAWT-00-0000-00000LEE3 - White 114lm 350mA 2.85Vf 5000K 115° Everlight - Everlight 45-21 Series Surface Mount LEDs 45-21/QK2C-B2832AC2CB2/2T - Warm White 2000mcd 20mA 3.25Vf 3050K 120° 45-21/LK2C-B38452C4CB2/2T - Nuetral White 2000mcd 20mA 3.25Vf 4150K 120° 45-21/LK2C-B50634C6CB2/2T - Cold White 2200mcd 20mA 3.25Vf 5650K 120° PLCC2 Reverse Mount LS T77K-J1L2-1-0-2-R18-Z - Red 11.25mcd 2mA 1.8Vf 630nm 120° LO T77K-L1M2-24-Z - Orange 19.6mcd 2mA 1.8Vf 606nm 120° LY T77K-K2M1-26-Z - Yellow 15.7mcd 2mA 1.8Vf 587nm 120°
CN4 = microbuilder:USB: USB Connectors USBMINIB - Surface Mount Female Mini-B USB Connector 4UConnector: 06564
D1 = microbuilder:DIODE: Diode SMA Model Volts Amps Type Vf Ir Digikey # Notes SSA34-E3 40V 3A Schottky 480mV @ 3A 200uA @ 40V SSA34-E3/61TGITR-ND CDBA120-G 20V 1A Schottky 500mV @ 1A 500uA @ 20V 641-1014-6-ND REEL MBRA210 10V 2A Schottky 350mV @ 2A 700uA @ 10V MBRA210LT3 SOD-123 Model Volts Amps Type Vf Ir Order # Notes BAT54T1G 30V 200mA Schottky 800mV @ 200mA 2uA @ 25V BAT54T1GOSTR-ND B0530W 30V 500mA Schottky 430mV @ 500mA 130uA @ 30V B0530W-FDICT-ND REEL MBR120 20V 1A Schottky 340mV @ 1A MBR120VLSFT1GOSCT-ND SOD-323 Model Volts Amps Type Vf Ir Order # Notes PMEG2005EJ 20V 500mA Schottky 355mV @ 500mA 568-4110-1-ND ZLLS410 10V 570mA Schottky 380mV @ 570mA ZLLS410CT-ND 1N4148WS 75V 150mA Silicon/Simple 1V 1N4148WSFSCT-ND REEL SOD-523 Model Volts Amps Type Vf Ir Order # Notes BAT54XV2 30V 200mA Schottky 0.8V @ 100mA BAT54XV2CT-ND TB751S 30V 30mA Schottky RB751S-40TE61CT-ND SOT23-R/W (R = Solder Paste/Reflow Ovens, W = Hand-Soldering) Model Volts Amps Type Vf Ir Order # Notes BAT54FILM 40V 300mA Schottky 497-7162-1-ND POWERDI-5 Model Volts Amps Type Vf Ir Order # Notes PDS560 60V 5A Schottky 670mV @ 5A 150uA @ 60V PDS560DICT-ND
IC1 = microbuilder:INA260
J4 = SparkFun-Connectors:CONN_04: Multi connection point. Often used as Generic Header-pin footprint for 0.1 inch spaced/style header connections On any of the 0.1 inch spaced packages, you can populate with these: Break Away Headers - Straight <https://www.sparkfun.com/products/116> (PRT-00116) Break Away Male Headers - Right Angle <https://www.sparkfun.com/products/553> (PRT-00553) Female Headers <https://www.sparkfun.com/products/115> (PRT-00115) Break Away Headers - Machine Pin <https://www.sparkfun.com/products/117> (PRT-00117) Break Away Female Headers - Swiss Machine Pin <https://www.sparkfun.com/products/743> (PRT-00743) For SCREWTERMINALS and SPRING TERMINALS visit here: Screw Terimnals on SparkFun.com <https://www.sparkfun.com/search/results?term=Screw+Terminals> (5mm/3.5mm/2.54mm spacing) This device is also useful as a general connection point to wire up your design to another part of your project. Our various solder wires solder well into these plated through hole pads. Hook-Up Wire - Assortment (Stranded, 22 AWG) <https://www.sparkfun.com/products/11375> (PRT-11375) Hook-Up Wire - Assortment (Solid Core, 22 AWG) <https://www.sparkfun.com/products/11367> (PRT-11367) View the entire wire category on our website here <https://www.sparkfun.com/categories/141> Special notes: Molex polarized connector foot print use with SKU : PRT-08231 with associated crimp pins and housings. 1MM SMD Version SKU: PRT-10208; PROD_ID: CONN-09696
JD0 JD1-JD6 = SparkFun-Connectors:QWIIC_CONNECTOR: SparkFun I2C Standard Qwiic Connector An SMD 1mm pitch JST connector makes it easy and quick (get it? Qwiic?) to connect I2C devices to each other. The Qwiic system <http://www.sparkfun.com/qwiic> enables fast and solderless connection between popular platforms and various sensors and actuators. We carry 200mm <https://www.sparkfun.com/products/14204>, 100mm <https://www.sparkfun.com/products/14205>, 50mm <https://www.sparkfun.com/products/14206>, and breadboard friendly <https://www.sparkfun.com/products/14207> Qwiic cables. We also offer 10 pcs strips <https://www.sparkfun.com/products/14323> the SMD connectors.; PROD_ID: CONN-14483; VALUE: Vertical Qwiic Connector
JP1 = jumper:JP1Q: JUMPER
L2 = gritsbotx_electronics:MURATA_DFE252012P-1R5M=P2
L3 = microbuilder:INDUCTOR: Inductors 0603: 10nH Ceramic Inductor - microwire antenna/RF (Digikey: 712-1434-2-ND) 0805: 560nH Ceramic Inductor - RF (Digikey: 553-1047-1-ND) 270nH Ceramic Inductor - Q = 40@250MHz, +-5%, 1 Ohm DC Resistance (Digikey: 535-10506-2-ND) 1007 (2518 Metric) SMT: 10µH 10% 250mOhm 820mA 1007 Inductor (Digikey: 587-2189-1-ND) 22µH 10% 500mOhm 580mA 1007 Inductor (Digikey: 587-2190-1-ND) 47µH 10% 950mOhm 420mA 1007 Inductor (Digikey: 587-2191-1-ND) 47µH 5% 100mOhm 1A 1008 Inductor (Digikey: 732-1816-1-ND) 5.0x5.0mm (Taiyo Yuden NR5040 Series) 6.8µH 20% 2.3A 64mOhm Inductor (Digikey: 587-2374-2-ND) 5.0x5.0mm (TDK VLC5045 Series) 4.7µH 20% 3.3A 34mOhm Inductor (Digikey: 445-6526-1-ND) 6.8µH 20% 2.7A 46mOhm Inductor (Digikey: 445-6527-1-ND) 6.0x6.0mm (TDK VLC6045 Series) 4.7µH 20% 3.8A 27mOhm Inductor (Digikey: 445-6538-2-ND) 6.8µH 20% 3A 41mOhm Inductor (Digikey: 445-6540-1-ND) 6.2µH 30% 2.2A 45mOhm Inductor (Digikey: SRR5028-6R2YCT-ND) - Not TDK VLC6045 but footprint should match 6.0x6.0mm (TDK SLF6045 Series) 6.8uH 30% 2A 33mOhm Inductor (Digikey: 445-4572-1-ND, Mouser: 810-SLF645T6R8N2R0PF) 6.0x6.0mm (Sumida CDRH5D28 Series) 6.2uH 30% 1.8A 45mOhm Inductor (Digikey: 308-1542-1-ND) Taiyo Yuden NR3015T2R2M - 2.2uH 20% 1.5A (Digikey: 587-1648-2-ND, Mouser: 963-NR3015T2R2M) - Used with TI TPS62172 CoilCraft RFID Transponder Coil - MA5532-AE (For use with AS3935 Lightning Sensor) Vishay IHLP 1.0uH Molded Inductor - 24mOhm DCR, 5A, +/-20%, -55°C-125°C (Digikey: 541-1319-1-ND)
MOTORL MOTORR = adafruit:PINHD-1X6: PIN HEADER
Q2 = microbuilder:MOSFET-P: P-Channel Mosfet LEGEND VDS: Voltage Drain-Source ID: Drain Current RDS(ON): Drain-Source On-State Resistance VGS(TH): Gate-Source Threshold Voltage CISS: Drain-Source Input Capacitance SOT-23 Name VDS ID RDS(ON) VGS(TH) CISS Order Number IRLML5103 30V 760mA 600 mOhm -- 75pF @ 25V Digikey: IRLML5103PBFCT-ND IRLML6401 12V 4.3A 50 mOhm 950mV @ 250µA 830pF @ 10V Digikey: IRLML6401PBFTR-ND NTR0202PL 20V 400mA 800 mOhm 2.3V @ 250uA 70pF @ 5V Digikey: NTR0202PLT1GOSTR-ND NTR4101PT1G 20V 1.8A 85 mOhm 1.2V @ 250uA 675pF @ 10V Digikey: NTR4101PT1GOSCT-ND DMP2004K 20V 600mA 900 mOhm 1V @ 250uA 175pF @ 16V Digikey: DMP2004KDICT-ND PMV65XP 20V 3.9A 76 mOhm 950mV @ 1mA 725pF @ 20V Digikey: 568-2358-2-ND TO-252 Name VDS ID RDS(ON) VGS(TH) CISS Order Number AOD417 30V 25A 34 mOhm 3V @ 250µA 920pF @ 15V Digikey: 785-1106-2-ND
R1 R4 R11-R16 R21 R22 R24-R27 R119-R124 THERM6 = microbuilder:RESISTOR: Resistors
R3 R9 = microbuilder:RESISTOR_4PACK: Resistor Packs (4 resistors) 4 x 0603 10K 1/16W - Digikey: YC164J-10KCT-ND
R28-R41 = SparkFun-Resistors:4.7KOHM: 4.7kΩ resistor A resistor is a passive two-terminal electrical component that implements electrical resistance as a circuit element. Resistors act to reduce current flow, and, at the same time, act to lower voltage levels within circuits. - Wikipedia; PROD_ID: RES-07857
R49 = SparkFun-Resistors:10KOHM: 10kΩ resistor A resistor is a passive two-terminal electrical component that implements electrical resistance as a circuit element. Resistors act to reduce current flow, and, at the same time, act to lower voltage levels within circuits. - Wikipedia; PROD_ID: RES-00824
R50 = SparkFun-Resistors:1KOHM: 1kΩ resistor A resistor is a passive two-terminal electrical component that implements electrical resistance as a circuit element. Resistors act to reduce current flow, and, at the same time, act to lower voltage levels within circuits. - Wikipedia; PROD_ID: RES-07856
S1 = MHSS1105:MHSS1105: APEM - MHSS1105 - SLIDE SWITCH, SPDT, 0.3A, 6VDC, TH Source: Datasheet <https://componentsearchengine.com/Datasheets/2/MHSS1105.pdf>; DESCRIPTION: APEM - MHSS1105 - SLIDE SWITCH, SPDT, 0.3A, 6VDC, TH; HEIGHT: 4mm; MANUFACTURER_NAME: Apem; MANUFACTURER_PART_NUMBER: MHSS1105; MOUSER_PART_NUMBER: 642-MHSS1105; MOUSER_PRICE-STOCK: https://www.mouser.co.uk/ProductDetail/Apem/MHSS1105?qs=pNV45xh2Ia0pDJDMcFqmnQ%3D%3D
T1 = Transistor:*-PNP_DRIVER-: PNP Bias Resistor Transistor
TEENSY_POWER = SparkFun-LED:LED-RED: Red SMD LED Used in manufacturing of most products at SparkFun Packages: 0603 - SMD 0603 package [Product Link] <http://docs.avagotech.com/docs/AV02-0551EN> 0603 SMART - SMD 0603 SMART package ( more efficient and expensive)[Product Link] <http://www.osram-os.com/Graphics/XPic2/00077099_0.pdf> 1206 - SMD1206 package [Product Link] <https://www.sparkfun.com/datasheets/DevTools/LilyPad/Q150OVS4.pdff> SparkFun Products: Pro Mini 328 -5V <https://www.sparkfun.com/products/821> RedBoard <https://www.sparkfun.com/products/12757> IOIO-OTG <https://www.sparkfun.com/products/13613>; PROD_ID: DIO-00819
U1 = Texas Instruments - TPS61030PWP:TEXAS_INSTRUMENTS_TPS61030PWP: Boost Switching Regulator IC Positive Adjustable 1.8V 1 Output 3.6A (Switch) 16-TSSOP (0.173", 4.40mm Width) Exposed Pad; CENTROID_NOT_SPECIFIED: No; CURRENT_-_OUTPUT: 3.6A (Switch); DATASHEET: http://www.ti.com/lit/gpn/tps61030; DIGIKEY_DESCRIPTION: IC Boost Switching Regulator IC Positive Adjustable 1.8V 1 Output 3.6A (Switch) 16-TSSOP (0.173", 4.40mm Width) Exposed Pad; DIGIKEY_PART_NUMBER: 296-27006-5-ND; FREQUENCY_-_SWITCHING: 600kHz; FUNCTION: Step-Up; LEAD_FREE: yes; MF: Texas Instruments; MFG_PACKAGE_IDENT: PWP (R-PDSO-G16); MOUSER_PART_NUMBER: 595-TPS61030PWP; MPN: TPS61030PWP; OUTPUT_TYPE: Adjustable; PACKAGE: HTSSOP16; PREFIX: U; ROHS: yes; TEMPERATURE_RANGE_HIGH: +85°C; TEMPERATURE_RANGE_LOW: -40°C; VOLTAGE_-_INPUT_(MAX): 5.5V; VOLTAGE_-_INPUT_(MIN): 1.8V; VOLTAGE_-_OUTPUT_(MAX): 5.5V; VOLTAGE_-_OUTPUT_(MIN/FIXED): 1.8V
U3 = microbuilder:TB6612FNG: TB6612FNG Dual H-Bridge Motor Driver
U5 = SparkFun-IC-Logic:PCA9548A: Texas Instruments PCA9548A - I2C Multiplexer The PCA9548A device has eight bidirectional translating switches that can be controlled through the I2C bus. The SCL/SDA upstream pair fans out to eight downstream pairs, or channels. Any individual SCn/SDn channel or combination of channels can be selected, determined by the contents of the programmable control register. These downstream channels can be used to resolve I2C slave address conflicts.; PROD_ID: IC-13948
U16 = microbuilder:MCP73871: MCP73871 Lithium Polymer Battery Charger Digikey: MCP73871-2CCI/ML-ND
U$6 = microbuilder:BNO055: BNO055 - Motion Co-Processor
U$8 U$30-U$37 U$43 U$45-U$48 = microbuilder:MOUNTINGHOLE: Mounting Hole For #2 screws (0.086"/2.18mm width, 0.094"/2.4mm hole) use 2.5mm; BOM: EXCLUDE
U$12 = Gritsbot_Library:TPS61252: Texas Instrument 1.5-A Boost Converter With Adjustable Input Current Limit. (2.7 - 6V input range to 0 - 6.5V output)
U$57 = teensy:TEENSY40: Teensy 4.0 device including POGO pins for pins 24 - 33, but not yet pins for D+ and D-. Symbol layout is what works for me and may not suite everyone... that can be added or additional symbols can be created to be used in a modilied davie name.
X2 = adafruit2:XTAL: Low cost SMT crystals, no capacitors included http://www.ladyada.net/library/eagle

## Net classes
1 highpower: width 0.406 mm, drill 0.483 mm

## Board
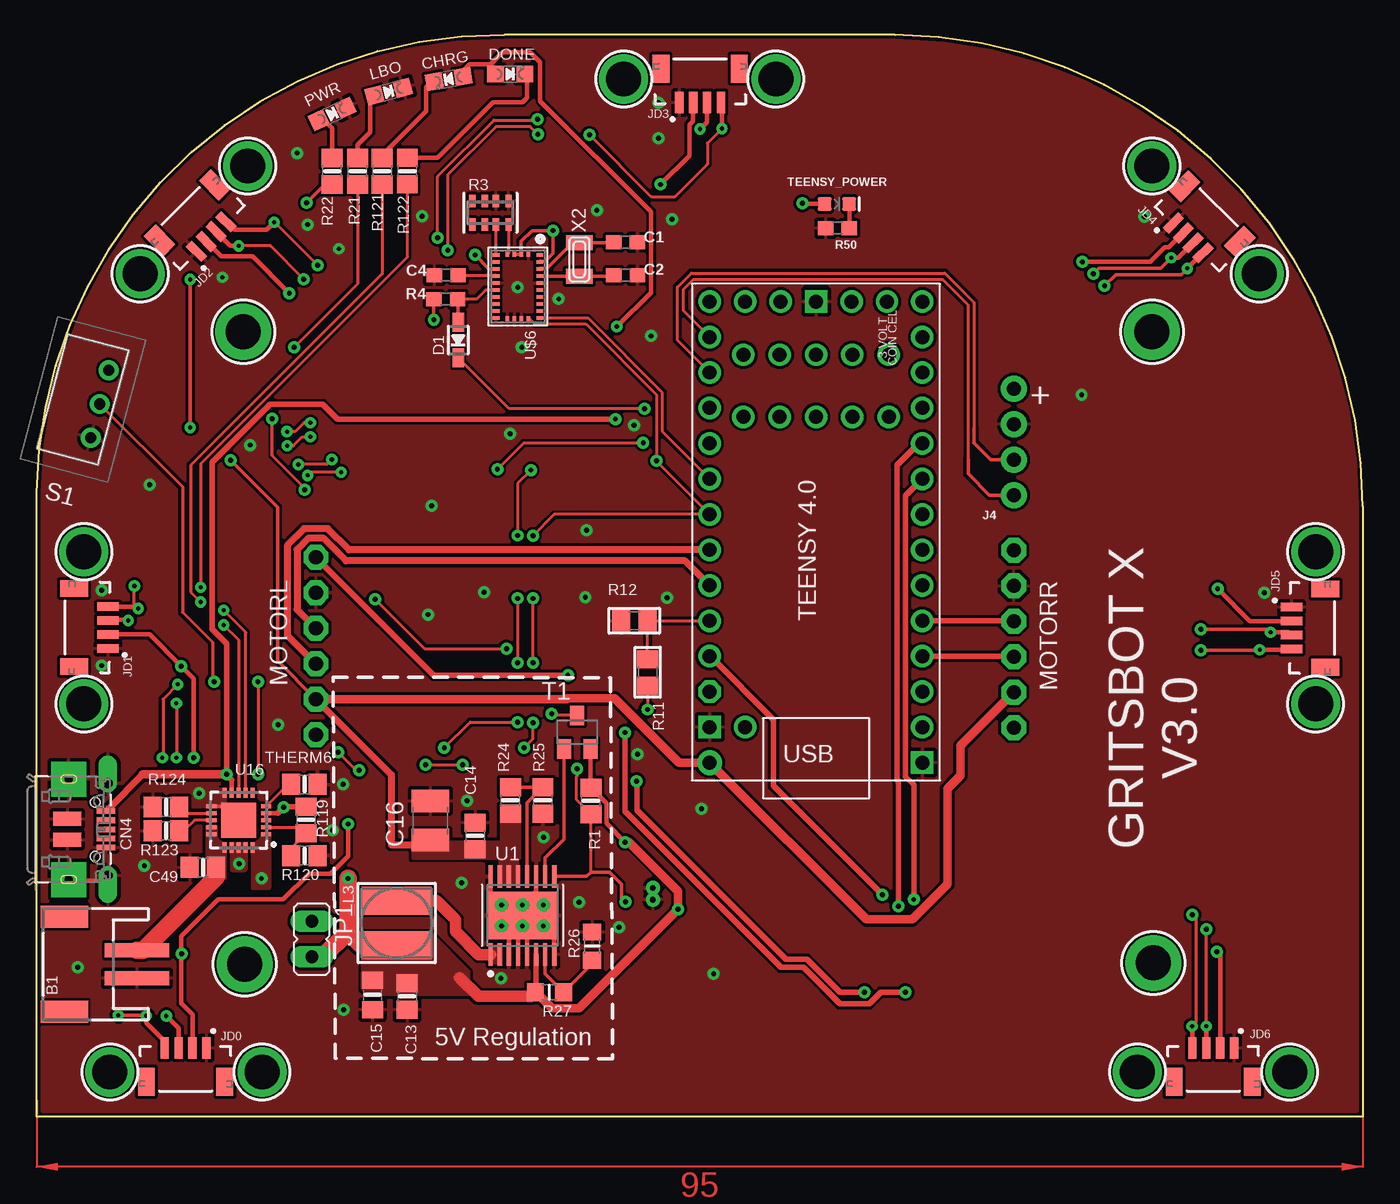
[diagram p5: board, top side]
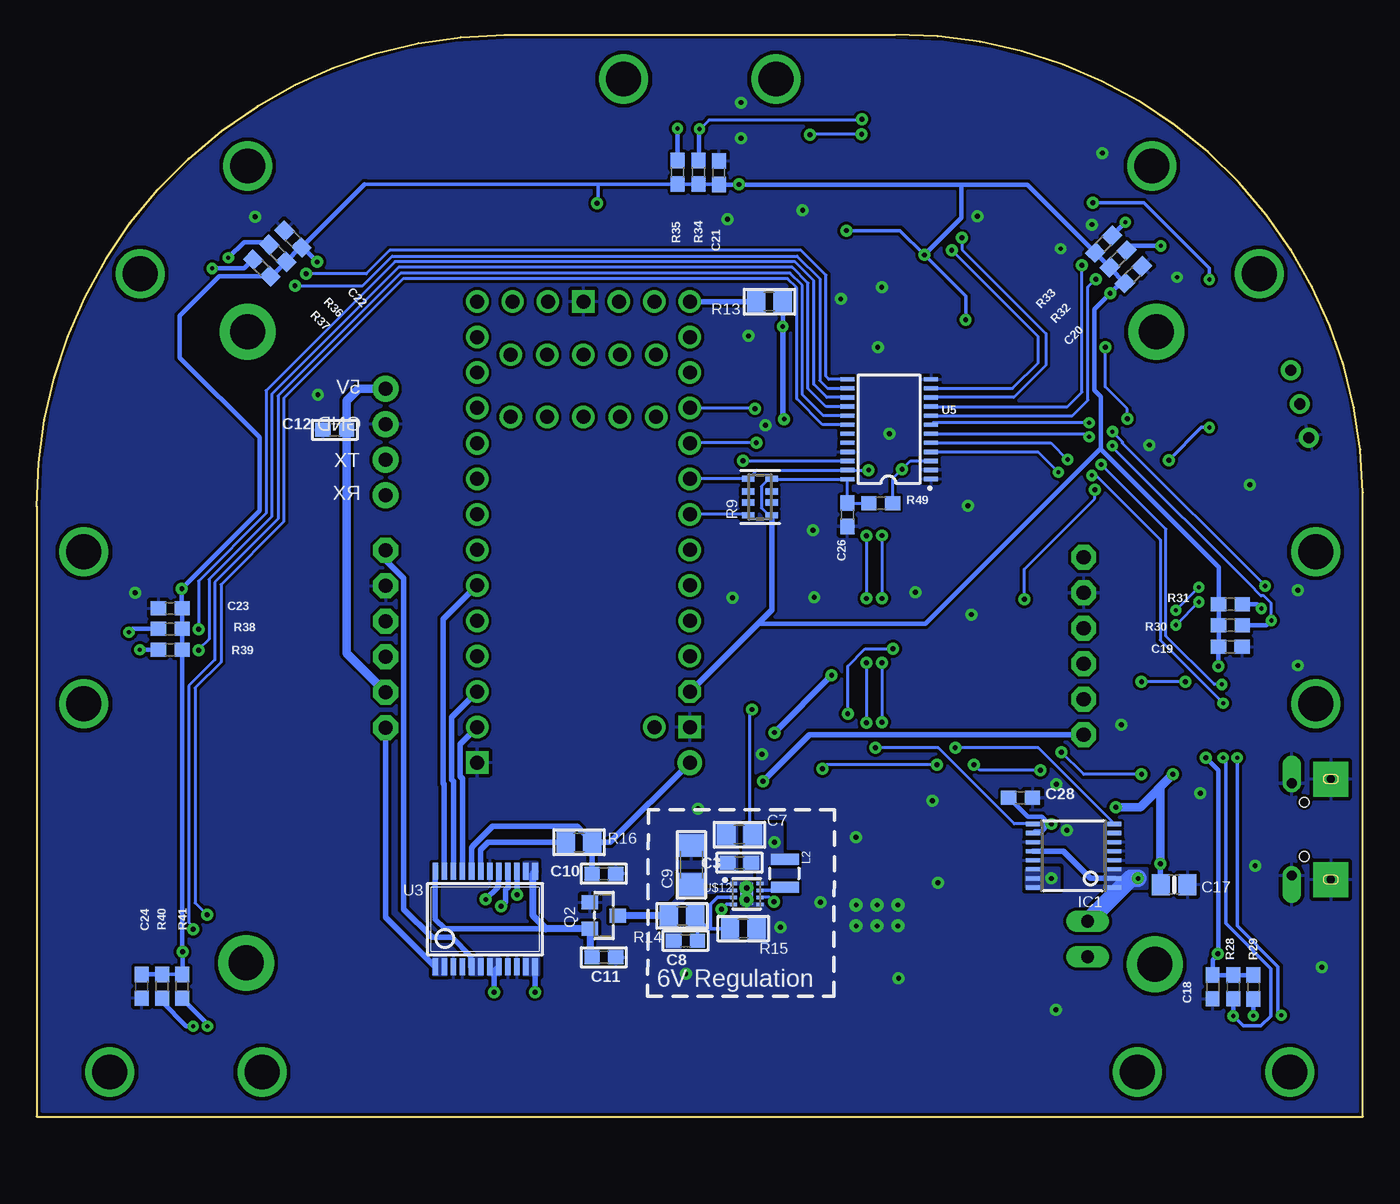
[diagram p6: board, bottom side, seen from below]

Size 95 x 77.46 mm. Coordinates in mm from the lower left corner, seen from the top.
Outline: 95,0 0,0 0,44.7 arc-90 33.5,77.46 61.5,77.46 arc-90 95,43.7 95,0
Copper layers (1*16): Top / Bottom
Stack-up Default Layer Stack: Top User Defined 0.035mm / Dielectric-1 User Defined 1.5mm / Bottom User Defined 0.035mm
Design rules "SparkFun *": minimum track width 8mil, minimum drill 0.3mm, track to track 8mil, track to pad 8mil, pad to pad 8mil, via to via 8mil, smd to smd 8mil, copper to edge 8mil, drill to drill 8mil, minimum pad ring 12mil, minimum via ring 10mil, stop-mask expansion 4mil, vias tented up to drill 20mil, thermal gap 10mil

### Footprints (pad centres in the part's own frame; a part is rotated, then mirrored left to right if it is on the bottom)
JSTPH2 = smd 1 x 4.6: 1 -1,-3.7; 2 1,-3.7 | smd 1.6 x 3.4: NC1 -3.4,1.5; NC2 3.4,1.5
0603-NO = smd 1.1 x 1: 1 -0.85,0; 2 0.85,0
0603 = smd 1.1 x 1: 1 -0.85,0; 2 0.85,0
0805 = smd 1.3 x 1.5: 1 -0.95,0; 2 0.95,0
1206 = smd 1.6 x 1.8: 1 -1.4,0; 2 1.4,0
0805-NO = smd 1.3 x 1.5: 1 -0.95,0; 2 0.95,0
0805_10MGAP = smd 1.2 x 1.5: 1 -1.05,0; 2 1.05,0
C1210 = smd 1.6 x 2.7: 1 -1.4,0; 2 1.4,0
CHIPLED_0805_NOOUTLINE = smd 1.2 x 1.2: A 0,-1.05; C 0,1.05
4UCONN_20329 = smd 1 x 2: BASE@1 -0.75,-2; BASE@2 0.75,-2 | smd 0.4 x 1.35: D+ 0,0.775; D- -0.65,0.775; GND 1.3,0.775; ID 0.65,0.775; VBUS -1.3,0.775 | drill 0.7 offset: SPRT@1 -3.3,0.9; SPRT@2 3.3,0.9 | drill 0.6 pad 2.5 square: SPRT@3 -3.6,-1.9; SPRT@4 3.6,-1.9 | hole 0.7: -1.95,0; 1.95,0
SOD-323 = smd 1.35 x 0.8: A 1.27,0; C -1.27,0
TSSOP16 = smd 0.305 x 0.991: 1 -2.275,-2.918; 2 -1.625,-2.918; 3 -0.975,-2.918; 4 -0.325,-2.918; 5 0.325,-2.918; 6 0.975,-2.918; 7 1.625,-2.918; 8 2.275,-2.918; 9 2.275,2.918; 10 1.625,2.918; 11 0.975,2.918; 12 0.325,2.918; 13 -0.325,2.918; 14 -0.975,2.918; 15 -1.625,2.918; 16 -2.275,2.918
1X04_NO_SILK = drill 1.016 pad 1.88: 1 0,0; 2 2.54,0; 3 5.08,0; 4 7.62,0
JST04_1MM_VERT = smd 0.6 x 1.55: 1 -1.478,0.775; 2 -0.478,0.775; 3 0.522,0.775; 4 1.522,0.775 | smd 1.2 x 2: NC1 -2.778,3.2; NC2 2.822,3.2
JP1 = drill 0.914 long: 1 0,-1.27; 2 0,1.27
MURATA_DFE252012P-1R5M=P2 = smd 0.8 x 2: P$1 -1,0; P$2 1,0
INDUCTOR_5X5MM_TDK_VLC5045 = smd 2 x 5: P$1 -1.6,0; P$2 1.6,0
1X06-CLEANBIG = drill 1.016 pad 1.778 octagon: 1 -6.35,0; 2 -3.81,0; 3 -1.27,0; 4 1.27,0; 5 3.81,0; 6 6.35,0
SOT23-WIDE = smd 1 x 1.2: 1 -0.95,-1; 2 0.95,-1; 3 0,1
RESPACK_4X0603 = smd 0.45 x 0.9: 1 -1.3,-0.85; 2 -0.4,-0.85; 3 0.4,-0.85; 4 1.3,-0.85; 5 1.3,0.85; 6 0.4,0.85; 7 -0.4,0.85; 8 -1.3,0.85
_0805MP = smd 1.2 x 1.3: 1 -1.016,0; 2 1.016,0
MHSS1105 = drill 0.8 pad 1.3: 1 1.25,2.5; 2 1.25,0; 3 1.25,-2.5
SC59-BEC = smd 1 x 1.4: B -0.95,-1.2; C 0,1.2; E 0.95,-1.2
LED-0603 = smd 1 x 1: A -0.877,0; C 0.877,0
TEXAS_INSTRUMENTS_TPS61030PWP_0 = smd 0.3 x 1.6: 1 -2.275,-2.8; 2 -1.625,-2.8; 3 -0.975,-2.8; 4 -0.325,-2.8; 5 0.325,-2.8; 6 0.975,-2.8; 7 1.625,-2.8; 8 2.275,-2.8; 9 2.275,2.8; 10 1.625,2.8; 11 0.975,2.8; 12 0.325,2.8; 13 -0.325,2.8; 14 -0.975,2.8; 15 -1.625,2.8; 16 -2.275,2.8 | smd 5 x 3.4: 17 0,0 | drill 0.33 pad 0.63: PAD_1 -1.5,0.75; PAD_2 0,0.75; PAD_3 1.5,0.75; PAD_4 -1.5,-0.75; PAD_5 0,-0.75; PAD_6 1.5,-0.75
SSOP24 = smd 0.4 x 1.2: 1 -3.575,-3.42; 2 -2.925,-3.42; 3 -2.275,-3.42; 4 -1.625,-3.42; 5 -0.975,-3.42; 6 -0.325,-3.42; 7 0.325,-3.42; 8 0.975,-3.42; 9 1.625,-3.42; 10 2.275,-3.42; 11 2.925,-3.42; 12 3.575,-3.42; 13 3.575,3.42; 14 2.925,3.42; 15 2.275,3.42; 16 1.625,3.42; 17 0.975,3.42; 18 0.325,3.42; 19 -0.325,3.42; 20 -0.975,3.42; 21 -1.625,3.42; 22 -2.275,3.42; 23 -2.925,3.42; 24 -3.575,3.42
TSSOP28 = smd 1 x 0.3: 1 -3,3.57; 2 -3,2.925; 3 -3,2.275; 4 -3,1.625; 5 -3,0.975; 6 -3,0.325; 7 -3,-0.325; 8 -3,-0.975; 9 -3,-1.625; 10 -3,-2.275; 11 -3,-2.925; 12 -3,-3.575; 13 3,-3.575; 14 3,-2.925; 15 3,-2.275; 16 3,-1.625; 17 3,-0.975; 18 3,-0.325; 19 3,0.325; 20 3,0.975; 21 3,1.625; 22 3,2.275; 23 3,2.925; 24 3,3.575
QFN20_4MM = smd 0.73 x 0.28: P$1 -1.965,1; P$2 -1.965,0.5; P$3 -1.965,0; P$4 -1.965,-0.5; P$5 -1.965,-1; P$11 1.965,-1; P$12 1.965,-0.5; P$13 1.965,0; P$14 1.965,0.5; P$15 1.965,1 | smd 0.28 x 0.73: P$6 -1,-1.965; P$7 -0.5,-1.965; P$8 0,-1.965; P$9 0.5,-1.965; P$10 1,-1.965; P$16 1,1.965; P$17 0.5,1.965; P$18 0,1.965; P$19 -0.5,1.965; P$20 -1,1.965 | smd 2.5 x 2.5: P$21 0,0
BNO055 = smd 0.25 x 0.475: 1 -2.25,1.562; 6 -2.25,-1.562; 7 -1.75,-1.562; 8 -1.25,-1.562; 9 -0.75,-1.562; 10 -0.25,-1.562; 11 0.25,-1.562; 12 0.75,-1.562; 13 1.25,-1.562; 14 1.75,-1.562; 15 2.25,-1.562; 20 2.25,1.562; 21 1.75,1.562; 22 1.25,1.562; 23 0.75,1.562; 24 0.25,1.562; 25 -0.25,1.562; 26 -0.75,1.562; 27 -1.25,1.562; 28 -1.75,1.562 | smd 0.375 x 0.25: 2 -2.312,0.75; 3 -2.312,0.25; 4 -2.312,-0.25; 5 -2.312,-0.75; 16 2.312,-0.75; 17 2.312,-0.25; 18 2.312,0.25; 19 2.312,0.75
MOUNTINGHOLE_2.5_PLATED_THICK = drill 2.5 pad 4: P$1 0,0
MOUNTINGHOLE_2.5_PLATED = drill 2.5 pad 3.2: P$1 0,0
TPS61252 = smd 0.5 x 0.25: 1 -0.95,0.75; 2 -0.95,0.25; 3 -0.95,-0.25; 4 -0.95,-0.75; 5 0.95,-0.75; 6 0.95,-0.25; 7 0.95,0.25; 8 0.95,0.75 | drill 0.4 pad 0.457: P$2_GND 0,0.423; P$3_GND 0,-0.423 | smd 0.9 x 1.6: THERMAL_GND 0,0
TEENSY40 = drill 1: 0-RX1 -13.97,-7.62; 1-TX1 -11.43,-7.62; 2-OUT2 -8.89,-7.62; 3-LRCLK2 -6.35,-7.62; 3V3-2 16.51,-2.54; 4-BCLK2 -3.81,-7.62; 5-IN2 -1.27,-7.62; 6-OUT1D 1.27,-7.62; 7-RX2/OUT1A 3.81,-7.62; 8-TX2/IN1 6.35,-7.62; 9-OUT1C 8.89,-7.62; 10-CS/MQSR 11.43,-7.62; 11-MOSI/CTX1 13.97,-7.62; 12-MIO/MQSL 16.51,-7.62; 13-SCK/CRX1/LED 16.51,7.62; 14-A0/TX3/S-PFI_OUT 13.97,7.62; 15-A1/RX3/S-PDIF_IN 11.43,7.62; 16-A2/RX4/SCL1 8.89,7.62; 17-A3/TX4/SDA1 6.35,7.62; 18-A4/SDA0 3.81,7.62; 19-A5/SCL0 1.27,7.62; 20-A6/TX5/LRCLK1 -1.27,7.62; 21-A7/RX5/BCLK1 -3.81,7.62; 22-A8/CTX1 -6.35,7.62; 23-A9/CRX1/CCLK1 -8.89,7.62; 24-A10/TX6/SCL2 12.7,5.207; 25-A11/SDA2 8.255,5.207; 26-A12/MOSI1 12.7,2.603; 27-A13/SCK1 8.255,2.603; 28-RX7 12.7,0; 29-TX7 8.255,0; 30-CRX3 12.7,-2.603; 31-CTX3 8.255,-2.603; 32-OUTB1 12.7,-5.207; 33-MCLK2 8.255,-5.207; ON/OFF 16.51,5.08; PROGRAM 16.51,2.54; VBAT 16.51,-5.08; VUSB -13.97,5.08 | drill 1 octagon: 3V3-1 -11.43,7.62 | drill 1 square: GND1 -16.51,-7.62; GND2 16.51,0; GND3 -13.97,7.62 | drill 1 pad 1.778: VIN -16.51,7.62
XTAL3215 = smd 1.1 x 1.9: P$1 1.2,0; P$2 -1.2,0

### Placement (x,y rotation side)
B1  3.48,10.91 90 top
C1  42.19,62.61 180 top
C2  42.19,60.25 180 top
C3  44.66,18.18 180 bottom
C4  29.33,60.26 0 top
C7  44.66,20.18 180 bottom
C8  48.51,12.59 0 bottom
C9  48.1,18.02 90 bottom
C10  54.37,17.39 0 bottom
C11  54.37,11.39 0 bottom
C12  73.65,49.18 0 bottom
C13  26.54,8.61 270 top
C14  31.41,20.1 90 top
C15  24.07,8.71 270 top
C16  28.2,21.2 90 top
C17  13.52,16.61 0 bottom
C18  10.76,9.28 270 bottom
C19  9.49,33.64 0 bottom
C20  16.44,60.29 45 bottom
C21  46.13,67.59 90 bottom
C22  76.63,62.84 135 bottom
C23  85.43,36.39 180 bottom
C24  87.49,9.32 270 bottom
C26  36.92,43.09 270 bottom
C28  24.52,22.83 0 bottom
C49  11.92,17.84 180 top
CHRG  29.51,74.29 100 top
CN4  4.19,20.57 270 top
D1  30.2,55.6 90 top
DONE  33.91,74.66 270 top
IC1  20.72,18.68 90 bottom
J4  70,44.5 90 top
JD0  10.69,5.69 180 top
JD1  5.88,35 90 top
JD2  13.03,62.46 45 top
JD3  47.5,71.85 0 top
JD4  81.93,62.39 315 top
JD5  89.12,35 270 top
JD6  84.31,5.69 180 top
JP1  19.71,12.71 180 top
L2  41.4,17.42 270 bottom
L3  25.78,13.86 90 top
LBO  25.22,73.4 285 top
MOTORL  20,33.7 90 top
MOTORR  70,34.2 90 top
PWR  21.16,71.8 295 top
Q2  54.37,14.39 270 bottom
R1  39.7,22.6 270 top
R3  32.5,64.73 0 top
R4  29.3,58.54 0 top
R9  43.18,44.37 90 bottom
R11  43.77,31.81 270 top
R12  42.81,35.5 0 top
R13  42.51,58.35 180 bottom
R14  48.77,14.37 0 bottom
R15  44.39,13.45 0 bottom
R16  56.15,19.64 0 bottom
R21  22.98,67.69 270 top
R22  21.15,67.69 90 top
R24  33.93,22.64 270 top
R25  36.26,22.64 90 top
R26  39.79,12.2 270 top
R27  36.73,8.9 180 top
R28  9.29,9.28 270 bottom
R29  7.83,9.28 270 bottom
R30  9.48,35.17 0 bottom
R31  9.48,36.67 0 bottom
R32  17.53,61.42 45 bottom
R33  18.57,62.48 45 bottom
R34  47.59,67.63 90 bottom
R35  49.09,67.62 90 bottom
R36  77.73,61.82 135 bottom
R37  78.88,60.77 135 bottom
R38  85.43,34.92 180 bottom
R39  85.43,33.42 180 bottom
R40  86.03,9.32 270 bottom
R41  84.58,9.32 270 bottom
R49  34.53,43.93 180 bottom
R50  57.36,63.63 0 top
R119  19.3,21.24 90 top
R120  19.18,18.69 0 top
R121  24.75,67.69 90 top
R122  26.55,67.7 90 top
R123  9.27,20.46 0 top
R124  9.27,22.17 0 top
S1  3.3,51.35 345 top
T1  38.72,27.53 0 top
TEENSY_POWER  57.33,65.36 0 top
THERM6  19.18,23.79 180 top
U1  34.8,14.4 0 top
U3  62.87,14.14 0 bottom
U5  33.93,49.22 180 bottom
U16  14.48,21.23 180 top
U$6  34.47,59.44 270 top
U$7  [MOUNTINGHOLE_2.5_PLATED_THICK]  14.8,56.2 0 top
U$8  42.05,74.3 0 top
U$12  44.14,15.95 0 bottom
U$23  [MOUNTINGHOLE_2.5_PLATED_THICK]  79.9,56.2 0 top
U$28  [MOUNTINGHOLE_2.5_PLATED_THICK]  14.9,10.9 0 top
U$29  [MOUNTINGHOLE_2.5_PLATED_THICK]  80,11 0 top
U$30  52.95,74.3 0 top
U$31  7.41,60.36 0 top
U$32  15.11,68.07 0 top
U$33  3.38,29.55 0 top
U$34  3.38,40.45 0 top
U$35  5.24,3.19 0 top
U$36  16.14,3.19 0 top
U$37  79.89,68.07 0 top
U$43  87.59,60.36 0 top
U$45  91.62,40.45 0 top
U$46  91.62,29.55 0 top
U$47  78.86,3.19 0 top
U$48  89.76,3.19 0 top
U$57  55.83,41.85 90 top
X2  38.87,61.37 270 top

### Tracks (layer width: path | path; a pad name or v marks a point on that pad's centre or on a via)
3.3V  (via drill 0.35)
  Top 0.254: v28.45,57.05 R4.1 | v31.4,61.7 32.41,60.69 U$6.8 | U$6.4 U$6.3 34.72,62.68 35.49,63.45 v37,63.45 37,61.83 36.41,61.24 36.08,61.24 U$6.28
  Top 0.305: v54.85,65.4 54.9,65.36 TEENSY_POWER.A | JD1.2 8.08,34.52 v10.35,32.25 11.25,31.35 v11.25,25.7 | JD0.2 11.17,7.3 10.37,8.1 10.37,11.63 10.35,11.65 | JD6.2 84.79,11.56 v84.55,11.8 | JD5.2 86.92,35.48 v84.6,37.8 | 10.35,11.65 10.35,12.9 13,15.55 17.65,15.55 19.5,17.4 21.05,17.4 22.3,18.65 v22.3,20.95 | v10.38,11.65 10.35,11.65 | v18.1,58.95 15.46,61.59 13.22,61.59 JD2.2 | v44.7,66.75 46.76,68.81 46.76,71.03 47.02,71.29 JD3.2 | JD4.2 81.12,62.26 80.81,62.26 79.79,61.23 74.93,61.23 v74.9,61.2
  Bottom 0.203: R9.1 42.56,43.07 43.09,43.6 43.09,45.14 42.56,45.67 R9.4 42.31,45.65 U5.24 36.92,45.63 C26.1 36.91,43.93 R49.2
  Bottom 0.254: v37,63.45 33.15,63.45 v31.4,61.7 28.45,58.75 v28.45,57.05 | 47.45,66.78 47.45,66.77 R35.1 54.8,66.77 | R34.1 46.17,66.78 C21.1 | R41.1 R40.1 | 54.8,66.77 71.5,66.77 | v54.85,65.4 54.8,65.45 54.8,66.77 | 79.03,48.63 79.03,48.6
  Bottom 0.305: 28.75,66.74 24.04,66.74 R33.1 R32.1 18.13,60.78 C20.1 17.36,59.69 v18.1,58.95 19.23,57.81 19.23,52.02 18.77,51.56 18.77,47.87 18.79,47.84 | 71.5,66.77 C22.1 | C22.1 76.12,62.24 R36.1 78.18,60.17 R37.1 81.92,60.17 84.75,57.35 84.75,54.35 79.03,48.63 | R40.1 C24.1 | R29.1 9.28,10.12 R28.1 C18.1 10.76,11.24 10.35,11.65 | v31.4,61.7 28.75,64.35 28.75,66.74 | v74.9,61.2 75.94,62.24 C22.1 | R41.1 84.55,10.2 v84.55,11.8 84.58,11.83 R39.1 R38.1 C23.1 84.6,36.41 v84.6,37.8 79.03,43.37 79.03,48.6 | v10.35,32.25 10.34,32.26 C19.1 R30.1 R31.1 10.33,39.35 18.76,47.78 18.76,47.81 18.79,47.84 | C21.1 v44.71,66.74 v44.7,66.75 v44.69,66.74 28.75,66.74 | 47.45,66.78 R34.1 | 22.79,20.95 22.79,20.65 23,20.44 23.5,20.44 IC1.10 | 22.79,20.95 22.79,21.25 23,21.46 24,21.46 C28.1 | 22.79,20.95 v22.3,20.95 | 10.35,11.65 10.35,24.79 10.94,25.38 10.94,25.39 v11.25,25.7 | 43.33,35.3 31.33,35.3 18.79,47.84 | 10.35,11.65 v10.38,11.65
  Bottom 0.406: R9.1 42.33,36.3 43.33,35.3 U$57.3V3-1
5.0V  (via drill 0.3, 0.35)
  Top 0.254: MOTORL.2 17.25,32.64 17.25,43.65 v13.9,47 | v11,59.95 v11,49.35 | v19.35,65.45 20.64,66.74 R22.1
  Top 0.508: MOTORL.2 25.4,24.49 25.4,19.45 28.07,19.45
  Top 0.61: MOTORL.2 37.96,29.89 38.01,29.94 41.41,29.94 46.01,25.34 U$57.VIN 59.44,14.12 62.72,14.12 65.23,16.62 65.23,23.46 66.16,24.4 66.16,26.55 MOTORR.2
  Bottom 0.254: v13.9,47 11.55,49.35 v11,49.35 | v11,59.95 11,60.75 15.7,65.45 v19.35,65.45
  Bottom 0.381: C10.1 55.22,19.62 R16.2 56.05,20.5 56.05,20.55 56.29,20.78 62.35,20.78 63.78,19.36 63.78,19.32 63.85,19.25 U3.20
  Bottom 0.406: U$57.VIN 53.91,19.64 R16.2
  Bottom 0.61: MOTORR.2 72.8,33.19 C12.2 72.8,51.25 71.93,52.12 J4.4
  pour Top (no thermals): 34.7,22.35 34.7,18.4 34.55,18.4 34.55,16.6 33.1,16.6 33.1,18.4 26.85,18.4 26.85,20.6 29.55,20.6 29.55,19.75 33.2,19.75 33.2,22.35
6.0V
  Bottom 0.508: R14.1 53.34,14.37 Q2.3
  pour Bottom (no thermals): 49.99,13.07 50.37,13.45 50.37,15.21 49.69,15.21 49.1,15.8 49.1,17.49 47.17,17.49 47.17,16.35 44.75,16.35 44.75,15.94 47.17,15.94 47.17,15.69 48.36,15.69 49.07,14.97 49.07,13.64 48.82,13.38 48.82,12.01 49.99,12.01
CHG_5V
  Bottom 0.406: U$57.13-SCK/CRX1/LED R13.2
ENABLE  (via drill 0.35)
  Top 0.203: 39.7,17.49 R1.2 38.65,22.7 38.65,24.33 38.7,24.38 v38.7,24.9 | S1.2 10.45,45.09 10.45,36.1 12.6,33.95 12.6,31.2 12.65,31.15 v12.7,31.15 | v15.85,31.15 v15.85,24.5 | v21.6,26.1 22.9,24.8 v23.1,24.8 | v27.85,25.2 v30.5,25.2
  Top 0.254: v42.19,15.38 41.89,15.69 41.89,16.63 41.03,17.49 39.7,17.49 39.41,17.2 U1.9
  Bottom 0.203: v42.19,15.38 42.51,15.7 U$12.6 | v12.7,31.15 v15.85,31.15 | v15.85,24.5 20,24.5 v21.6,26.1 | v23.1,24.8 27.45,24.8 v27.85,25.2 | v30.5,25.2 38.4,25.2 v38.7,24.9
ENCAL
  Top 0.508: MOTORL.3 19.99,32.43 17.94,34.47 17.94,40.9 19.15,42.11 20.85,42.11 22.38,40.58 U$57.20-A6/TX5/LRCLK1
ENCAR
  Top 0.406: U$57.2-OUT2 69.97,32.96 MOTORR.3
ENCBL
  Top 0.508: MOTORL.4 19.99,34.97 18.65,36.3 18.65,40.61 19.44,41.4 20.56,41.4 22.15,39.8 46.45,39.8 U$57.21-A7/RX5/BCLK1
ENCBR
  Top 0.406: U$57.3-LRCLK2 69.97,35.5 MOTORR.4
GND  (via drill 0.3, 0.35)
  Top 0.203: CN4.SPRT@2 4.77,16.95 3.35,16.95 3.15,16.75
  Top 0.254: U16.P$11 13.48,22.23 U16.P$21
  Top 0.305: U1.11 35.77,16.12 U1.PAD_2 | U1.16 32.52,15.93 U1.PAD_1 | U1.4 34.48,13.32 U1.PAD_5 35.12,13.32 U1.5 | U1.3 33.83,13.12 U1.PAD_4 | U1.8 37.08,12.88 U1.PAD_6
  other vias: 47.61,22.03 41.71,13.56 30.82,22.6 43.05,25.95 21.2,20.5 34.46,59.4 11.65,23.15 40.13,64.91 15.28,48.09 7.72,17.95 19.42,63.88 27.62,64.48 33.9,48.9 28.3,43.75 39.4,42 39.3,37.2 45.15,37.15 32.05,37.55 28.05,35.95 4.65,37.7 4.65,32.3 18.65,69 79.36,64.44 87.95,37.5 44.55,70.05 45.5,64.25 44,55.9 37.4,58.55 34.75,55.1 42.8,49.5 21.95,23.8 21.65,62.15 13.3,60.1 17.3,28.06 48.5,10.23 22,7.65 33.25,9.9 2.95,10.7 8.1,45.25 38.85,15.35 30.45,16.75 36.3,20 44.55,72.62 74.86,51.7
  pour Bottom (rank 4): 96.02,78.52 -2.72,78.52 -2.72,-0.74 96.02,-0.74
  pour Top (rank 4): 96.02,78.37 -1.52,78.37 -1.52,-1.25 96.02,-1.25
  pour Bottom (no thermals): 44.02,15.05 44.53,15.05 44.53,16.58 45.29,16.58 45.29,17.59 46.26,17.59 47.28,18.61 49.35,18.61 49.35,22.32 44.65,22.32 44.61,22.22 44.75,22.08 44.75,16.86 43.74,16.86 43.74,15.33 42.85,15.33 42.85,15.16 42.39,14.7 41.33,14.7 41.33,12.26 44.02,12.26
  pour Top (no thermals): 13.6,23.55 11.85,23.55 11.85,22.05 13.6,22.05
I2CMUX_!RST  (via drill 0.35)
  Top 0.203: v33,46.35 34.9,48.25 v43.45,48.25
  Bottom 0.203: R49.1 33.68,45.67 v33,46.35 32.4,46.95 U5.3 | v43.45,48.25 48.16,48.25 U$57.17-A3/TX4/SDA1
IMU_NRESET_3V
  Top 0.203: R4.2 31.5,58.54 32.15,59.19 U$6.11
  Top 0.254: R4.2 30.2,58.48 D1.A
IMU_RESET  (via drill 0.35)
  Top 0.203: v43.55,50.7 33.83,50.7 D1.C
  Bottom 0.203: U$57.16-A2/RX4/SCL1 43.59,50.74 v43.55,50.7
LBO
  Top 0.254: T1.B 37.77,19.87 36.42,18.52 U1.10
LMIN1  (via drill 0.35)
  Top 0.381: 62.25,43.97 62.25,24.33 62.83,23.75 v62.83,15.55
  Top 0.406: 62.25,43.97 62.25,44.47 U$57.7-RX2/OUT1A
  Bottom 0.381: U3.17 61.9,16.56 61.99,16.48 61.99,16.39 v62.83,15.55
LMIN2  (via drill 0.35)
  Top 0.381: 61.62,46.63 61.62,24.13 61.72,24.03 v61.72,15.05
  Top 0.406: 61.62,46.63 63.2,48.2 U$57.8-TX2/IN1
  Bottom 0.381: U3.16 61.25,16.39 61.4,16.23 61.4,15.37 v61.72,15.05
LMOUT+  (via drill 0.35)
  Top 0.381: v42.97,24.02 42.99,24 42.99,21.94 53.67,11.27 55.17,11.27 57.53,8.91 v59.31,8.91
  Bottom 0.381: v59.31,8.91 59.31,10.71 U3.12
  Bottom 0.406: v42.97,24.02 39.64,27.35 MOTORL.1
  pour Bottom (no thermals): 60.2,11.45 58.93,11.45 58.93,10.05 60.2,10.05
LMOUT-  (via drill 0.35)
  Top 0.381: v62.23,8.91 60.47,8.91 59.65,8.08 57.53,8.08 54.93,10.68 53.32,10.68 42.15,21.85 v42.15,27.5 | v42.15,27.5 | MOTORL.6 28.45,31.6 v38.05,31.6
  Bottom 0.381: U3.8 62.23,10.39 v62.23,8.91 | v42.15,27.5 v38.05,31.6
  pour Bottom (no thermals): 62.74,11.45 61.72,11.45 61.72,10.05 62.74,10.05
N$1
  Top 0.254: U1.12 35.12,22.46 R25.2 R24.1
N$3
  Top 0.254: U$6.27 36.08,60.73 36.55,60.73 38.39,62.57 X2.P$2 41.3,62.57 C1.2
N$4
  Top 0.254: U$6.26 38.85,60.19 X2.P$1 41.26,60.17 C2.2
N$5
  Top 0.203: C4.2 32.23,60.26 32.84,60.26 U$6.9
N$11
  Bottom 0.254: U$12.7 41.62,16.2 L2.P$2
N$12
  Bottom 0.254: C8.2 47.66,14.21 R14.2 46.9,13.45 46.74,13.45 | 46.74,13.45 R15.1 | U$12.3 46.22,15.7 46.74,15.19 46.74,13.45
N$13
  Top 0.813: L3.P$2 28.64,15.46 30,14.1 30,13.27 31.67,11.6 U1.1
  pour Top (no thermals): 33.25,12.3 33.25,10.9 32.45,10.9 32.45,12.3
N$14
  Top 0.254: R26.2 39.79,10.95 R27.1 36.42,10.22 U1.7
N$15
  Top 0.305: LBO.A 23.87,72.68 23.87,70.49 22.98,69.6 R21.1
N$17  (via drill 0.35)
  Top 0.203: T1.C 37.02,28.73 v36.9,28.85 | v33.65,33.5 27.8,33.5 v24.25,37.05 | v18.45,55.1 22.98,59.63 R21.2 | v16.88,49.98 16.88,47.33 19.2,45 v19.2,44.88
  Bottom 0.203: v36.9,28.85 36.9,32.25 35.65,33.5 v33.65,33.5 | v24.25,37.05 24.25,39.2 19.2,44.25 v19.2,44.88 | v16.88,49.98 16.88,50.67 18.45,52.25 v18.45,55.1
N$19
  Top 0.305: R22.2 21.15,70.77 20.77,71.16 20.26,71.16 20.21,71.21 PWR.A
N$22
  Top 0.305: TEENSY_POWER.C R50.2
N$100
  Top 0.203: R120.1 18.23,19.21 R119.1 18.87,20.73 U16.P$2
N$101  (via drill 0.3)
  Top 0.203: U16.P$7 14.98,34.67 v13.4,36.25 | v11.75,37.9 11.75,46.75 26.55,61.55 R122.1
  Bottom 0.203: v11.75,37.9 v13.4,36.25
N$102  (via drill 0.3)
  Top 0.203: U16.P$8 14.5,23.21 14.5,34.1 v13.4,35.2 | R121.1 24.75,60.35 11.04,46.64 11.04,37.56 v11.75,36.85
  Bottom 0.203: v11.75,36.85 v13.4,35.2
N$103
  Top 0.203: R123.2 10.54,20.46 11.31,21.23 U16.P$13
N$104
  Top 0.203: U16.P$5 18.01,23.79 THERM6.2
N$105
  Top 0.305: R122.2 28.72,68.66 32.71,72.64 34.8,72.64 35.12,72.96 35.12,74.24 DONE.C
N$106
  Top 0.305: CHRG.C 28.28,74.11 27.89,73.72 27.89,71.99 24.75,68.85 R121.2
N$107
  Top 0.203: U16.P$12 10.66,21.73 R124.2
PS0_3V
  Top 0.203: U$6.6 R3.3
PS1_3V
  Top 0.203: R3.4 33.8,62.08 33.79,62.06 33.79,61.82 U$6.5
PWML  (via drill 0.35)
  Top 0.381: v60.58,15.89 52.8,23.67 52.8,28.43
  Top 0.406: 52.8,28.43 48.27,32.96 U$57.23-A9/CRX1/CCLK1
  Bottom 0.381: U3.15 60.6,15.91 v60.58,15.89
PWMR
  Bottom 0.381: U3.23 65.8,23.3
  Bottom 0.406: 65.8,23.3 65.8,23.78 65.88,23.87 65.88,35.61 U$57.4-BCLK2
RMIN1
  Bottom 0.381: U3.21 64.5,24.18
  Bottom 0.406: 64.5,24.18 64.5,24.21 64.66,24.37 64.66,26.67 U$57.0-RX1
RMIN2
  Bottom 0.381: U3.22 65.15,23.48
  Bottom 0.406: 65.15,23.48 65.15,24 65.27,24.12 65.27,28.6 U$57.1-TX1
RMOUT+
  Bottom 0.406: MOTORR.1 70,14.27 U3.1
  pour Bottom (no thermals): 66.67,11.45 65.53,11.45 65.53,10.05 66.67,10.05
RMOUT-
  Bottom 0.381: U3.5 63.9,10.78 63.9,11.48 65.25,12.83 66.69,12.83 68.72,14.86 68.72,38.54 70,39.82 MOTORR.6
  pour Bottom (no thermals): 64.01,11.45 62.99,11.45 62.99,10.05 64.01,10.05
RPI_RX
  Top 0.203: U$57.14-A0/TX3/S-PFI_OUT 48.21,55.84 46.35,57.7 46.35,59.25 47.05,59.95 64.9,59.95 66.72,58.13 66.72,47.08 66.73,47.07
  Top 0.254: 66.73,47.07 66.73,46.02 68.25,44.5 J4.1
RPI_TX
  Top 0.203: U$57.15-A1/RX3/S-PDIF_IN 45.9,55.59 45.9,59.4 46.9,60.4 65.05,60.4 67.14,58.31 67.14,49.26 67.15,49.25
  Top 0.254: 67.15,49.25 67.15,48.25 68.36,47.04 J4.2
SCL0  (via drill 0.3)
  Top 0.203: v21.15,47.05 20.8,46.7 v18.75,46.7 | 7.78,7.25 7.83,7.19 | v10.1,30.95 9.05,29.9 9.05,25.75 v9,25.7
  Top 0.254: v5.84,7.25 7.78,7.25
  Top 0.305: JD0.4 9.17,5.39 7.83,6.72 7.83,7.19 v7.85,7.21 v7.85,7.22
  Bottom 0.203: U5.5 22.35,48.25 v21.15,47.05 | v10.1,30.95 10.65,30.95 14.11,34.41 14.11,42.06 v18.75,46.7
  Bottom 0.254: v5.84,7.25 6.08,7.48 6.08,10.74 9,13.67 v9,25.7
  Bottom 0.305: v7.85,7.22 7.83,7.24 R29.2
SCL1  (via drill 0.3)
  Top 0.203: 7,36.52 v7,38 | v19.6,49.69 19.59,49.7 19.15,49.7 18.5,49.05 v17.93,49.05
  Top 0.305: JD1.4 7,36.52 7.05,36.52 7.18,36.39 v7.27,36.39
  Bottom 0.203: v19.6,49.69 v19.61,49.7 30.78,49.7 U5.7 | v7,38 17.23,48.23 17.23,48.33 17.93,49.03 v17.93,49.05
  Bottom 0.305: R31.2 7.56,36.67 v7.27,36.39
SCL2  (via drill 0.3, 0.35)
  Top 0.203: v20.12,60.98 17.06,64.04 v17.01,64.04
  Top 0.305: JD2.4 | v17.01,64.04 16.46,63.5 14.14,63.5 JD2.4
  Bottom 0.203: U5.9 21.15,50.85 20.12,51.88 v20.12,60.98
  Bottom 0.305: R33.2 v17.01,64.04
SCL3  (via drill 0.3, 0.35)
  Top 0.203: v29.45,62.05 29.45,67.45 32.9,70.9 35.35,70.9 v35.9,70.35 | v39.6,70.3 44.05,65.85 45.7,65.85 48.05,68.2 48.05,69.72 v49.09,70.75
  Top 0.305: JD3.4 49.09,72.56 v49.09,70.75
  Bottom 0.203: U5.11 25.1,52.15 23.25,53.99 23.25,55.85 v29.45,62.05 | v35.9,70.35 39.55,70.35 v39.6,70.3
  Bottom 0.305: v49.09,70.75 R35.2
SCL4  (via drill 0.3, 0.35)
  Top 0.254: v76.5,59.5 77.29,60.29 81.99,60.29 v82.43,60.73
  Top 0.305: JD4.4 v82.43,60.74 v82.43,60.73 | JD4.4
  Bottom 0.203: U5.14 38.35,52.15 38.9,52.7 38.9,60 40.53,61.63 69.52,61.63 71.65,59.5 v76.5,59.5
  Bottom 0.305: v82.43,60.74 80.12,60.74 R37.2
SCL5  (via drill 0.3, 0.35)
  Top 0.203: 87.59,33.4 v87.61,33.42
  Top 0.254: v83.4,33.4 87.59,33.4
  Top 0.305: JD5.4 89.84,33.42 v87.61,33.42
  Bottom 0.203: U5.16 38.45,50.85 39.74,52.14 39.74,59.69 40.86,60.81 69.09,60.81 78.16,51.74 78.16,42.97 82.66,38.47 82.66,34.19 83.4,33.45 v83.4,33.4
  Bottom 0.305: v87.61,33.42 R39.2
SCL6  (via drill 0.3, 0.35)
  Top 0.203: v82.8,14.45 83.05,14.2 83.05,6.73 v82.79,6.47 v82.78,6.47 | v82.78,6.47
  Top 0.305: v82.79,6.47 JD6.4
  Bottom 0.203: U5.18 38.7,49.55 40.55,51.4 40.55,59.35 41.2,60 68.75,60 77.3,51.45 77.3,42.6 81.8,38.1 81.8,32.55 83.65,30.7 83.65,15.3 v82.8,14.45
  Bottom 0.305: R41.2 84.58,8.42 82.79,6.64 82.79,6.48 v82.78,6.47
SCL_MAIN  (via drill 0.35)
  Top 0.203: U$6.19 35.3,57.13 35.67,56.76 39.34,56.76 44.4,51.7 v44.4,46.95 44.4,46.94 U$57.19-A5/SCL0 37.07,43.12 v35.55,41.6 | v35.55,32.5 v35.55,37.1 | v35.55,28.2 35.55,27.05 v34.9,26.4
  Bottom 0.203: U$57.19-A5/SCL0 44.09,43.12 R9.8 | v44.4,46.95 U5.22 | v34.9,26.4 30.42,26.4 24.97,20.95 IC1.9 | v35.55,41.6 v35.55,37.1 | v35.55,32.5 v35.55,28.2
SDA0  (via drill 0.3)
  Top 0.203: v10,29.6 10.01,29.59 v10.01,25.7 | v21.81,46.14 19.64,46.14 v19.41,45.92
  Top 0.305: v9.29,7.2 10.17,6.32 JD0.3
  Bottom 0.203: U5.4 23.26,47.6 v21.81,46.14 | v10,29.6 14.52,34.12 14.52,41.3 19.13,45.92 v19.41,45.92
  Bottom 0.254: v9.29,7.2 8.57,6.48 7.29,6.48 6.58,7.2 6.58,10.6 9.82,13.84 9.82,25.5 v10.01,25.7
  Bottom 0.305: R28.2 v9.29,7.2
SDA1  (via drill 0.3)
  Top 0.203: v19.6,48.67 19.02,48.67 18.39,48.04 v17.94,48.04
  Top 0.305: v6.56,35.52 6.51,35.57 5.16,35.57 JD1.3
  Bottom 0.203: v6.56,35.52 6.56,36.77 7.08,37.29 7.29,37.29 7.71,37.71 17.94,47.94 v17.94,48.04 | U5.6 19.82,48.9 v19.6,48.67
  Bottom 0.305: R30.2 6.91,35.17 v6.56,35.52
SDA2  (via drill 0.3, 0.35)
  Top 0.203: v19.12,59.98 16.75,62.35 v14.48,62.35
  Top 0.305: v14.48,62.35 14.46,62.37 13.85,62.37 12.85,63.36 JD2.3
  Bottom 0.203: U5.8 20.8,50.2 19.69,51.31 19.69,59.41 v19.12,59.98
  Bottom 0.305: R32.2 16.6,62.35 v14.48,62.35
SDA3  (via drill 0.3, 0.35)
  Top 0.203: v35.88,71.41 35.81,71.35 32.75,71.35 28.73,67.33 28.73,62.93 v28.72,62.92
  Top 0.305: JD3.3 48.02,71.22 v47.52,70.72
  Bottom 0.203: U5.10 25,51.5 22.69,53.81 22.69,56.07 28.72,62.09 v28.72,62.92 | v35.88,71.41 35.94,71.35 46.84,71.35 47.47,70.72 v47.52,70.72
  Bottom 0.305: v47.52,70.72 47.54,70.73 47.54,68.53 R34.2
SDA4  (via drill 0.3, 0.35)
  Top 0.254: v75.7,60.35 76.1,60.75 80.53,60.75 v81.27,61.5
  Top 0.305: JD4.3 82.85,62.56 81.79,61.5 v81.27,61.5
  Bottom 0.203: U5.13 38.25,52.8 38.45,53 38.45,60.25 40.23,62.03 69.72,62.03 71.4,60.35 v75.7,60.35
  Bottom 0.305: v81.27,61.5 80.15,62.62 78.54,62.62 R36.2
SDA5  (via drill 0.3, 0.35)
  Top 0.254: v83.4,34.9 88.17,34.9 v88.39,34.68
  Top 0.305: JD5.3 89.69,34.68 v88.39,34.68
  Bottom 0.203: U5.15 38.4,51.5 39.33,52.43 39.33,59.85 40.7,61.22 69.33,61.22 78.56,51.99 78.56,43.19 83.4,38.35 v83.4,34.9
  Bottom 0.305: v88.39,34.68 88.14,34.92 R38.2
SDA6  (via drill 0.3, 0.35)
  Top 0.203: v83.79,6.47 83.79,13.21 v83.79,13.4
  Top 0.305: JD6.3 v83.79,6.47
  Bottom 0.203: U5.17 38.65,50.2 40.14,51.69 40.14,59.52 41.03,60.41 68.92,60.41 77.71,51.62 77.71,42.79 82.25,38.25 82.25,32.7 84.1,30.85 84.1,13.9 83.79,13.59 v83.79,13.4
  Bottom 0.305: R40.2 86.03,8.21 84.29,6.47 v83.79,6.47
SDA_MAIN  (via drill 0.35)
  Top 0.203: U$57.18-A4/SDA0 48.21,45.69 44.81,49.09 44.81,51.87 39.48,57.19 U$6.20 | v35.4,46.3 34.45,45.35 v34.45,41.61 | v34.45,37.1 v34.45,32.5 | v34.45,28.25 31.05,28.25 v29.2,26.4
  Bottom 0.203: U$57.18-A4/SDA0 R9.5 43.4,46.3 U5.23 v35.4,46.3 | IC1.8 23.25,26.4 v29.2,26.4 | v34.45,41.61 v34.45,37.1 | v34.45,32.5 v34.45,28.25
STBY
  Bottom 0.381: R16.1 62.67,19.64 63.2,19.11 U3.19
VBAT  (via drill 0.35)
  Top 0.203: v43.75,29.15 43.75,30.84 R11.2
  Top 0.305: v42.15,19.65 40.81,20.99 40.81,22.45 40.6,22.66 40.59,22.66 R1.1 39.67,23.58 T1.E
  Top 0.406: U1.6 35.78,8.9
  Top 0.61: v42.15,19.65 42.19,19.68 42.4,19.68 45.96,16.13 v45.96,14.86 v45.95,14.85 38.84,7.75 36.94,7.75 35.78,8.9 R27.2
  Top 0.813: R27.2 35.41,8.6 31.65,8.6 30.3,9.95
  Top 1.27: v22.3,17.05 22.3,13.25 | 22.3,13.25 23.29,12.26 L3.P$1 | JP1.2 20.49,11.44 22.3,13.25
  Bottom 0.203: C7.1 43.91,20.38 43.91,28.99 v43.75,29.15
  Bottom 0.254: U$12.4 45.6,15.2 v45.95,14.85
  pour Bottom (no thermals): 40.4,18.85 40.4,18 42.6,18 42.6,16.55 43.45,16.55 43.45,17.65 44.45,17.65 44.45,21 41.5,21 41.5,18.85
  pour Bottom (no thermals): 24.2,17.9 24.2,16.2 21.65,16.2 21.65,17.9
  pour Top (no thermals): 23.25,13.25 23.25,9.1 23.7,8.65 31.05,8.65 31.05,10.45 28.25,13.25
VBAT_IN  (via drill 0.35)
  Bottom 0.406: IC1.2 19.5,17.05 21.45,19 IC1.12
  Bottom 1.27: v16.1,17.05 16.63,17.05 JP1.1
  pour Top (no thermals): 15.35,19.65 15.35,16.25 16.8,16.25 16.8,20.35 16.05,20.35 16.05,20.05 15.65,19.65
  pour Bottom (no thermals): 18.3,17.85 18.3,16.25 15.35,16.25 15.35,17.85
VBAT_MEASURE
  Top 0.203: R11.1 R12.2 U$57.22-A8/CTX1
VBUS  (via drill 0.3, 0.35)
  Top 0.305: 17.28,21.73 U16.P$4 U16.P$3 | 13.98,24.12 U16.P$9 | DONE.A 33,74.58 32.77,74.81 32.77,75.06 32.52,75.31 | 32.52,75.31 32.47,75.36 31.02,75.36 30.55,74.88 CHRG.A | v41.55,56.57 44,59.01 44,64.8 36.08,72.71 36.08,75.49 35.35,76.22 33.38,76.22 32.52,75.36 32.52,75.31
  Top 0.406: 17.28,21.73 v17.7,22.15 17.74,22.19 R119.2 | 13.98,24.12 v13.6,24.5 13.6,33.85 12.56,34.89 12.56,46.84 16.72,51 20.5,51 21.55,49.95 v41.45,49.95 | 5.15,22.05 CN4.VBUS
  Top 0.508: 7.6,24.5 5.15,22.05
  Top 0.61: v13.6,24.5 7.6,24.5
  Bottom 0.305: v41.55,56.57 R13.1
  Bottom 0.406: v14.5,18.1 14.5,16.64 C17.1 | v41.55,56.57 41.55,50.05 v41.45,49.95
  Bottom 0.61: v17.7,22.15 15.95,22.15 v13.6,24.5 14.5,23.6 v14.5,18.1
  pour Top (no thermals): 13.85,19.65 15.1,19.65 15.1,17.5 13.85,17.5
VLIPO
  Top 1.27: B1.2 7.62,11.91 12.87,17.15 C49.1
  pour Top (no thermals): 12.1,20.9 12.95,20.9 12.95,20.05 13.35,19.65 13.6,19.65 13.6,16.95 12.1,16.95
VMOTOR
  Bottom 0.381: U3.24 66.45,14.14 65.75,13.44 58.51,13.44
  Bottom 0.508: C11.1 55.37,11.54 Q2.2 58.51,13.44 59.44,14.37 59.44,17.42 U3.13
  pour Bottom (no thermals): 60.2,18.3 59.05,18.3 59.05,16.91 60.2,16.91
(copper drawn outside any net)
  shapes: Top area x1

### Text on the board
tPlace: + | GRITSBOT X / V3.0 | 5V Regulation
bPlace: 6V Regulation
bNames: 5V | GND | TX | RX